# EasyEDA Pro project 15P1D_EDA.eprj

# Schematic SCH

## Sheets
1 P1: Board Name: B1; Create Date: 2024-03-08; Page Name: P1; Project Name: 15P1D_EDA; Schematic Name: SCH; Update Date: 2026-03-26; Company: EDA设计与开发; Page Size: A4; Version: V1.0
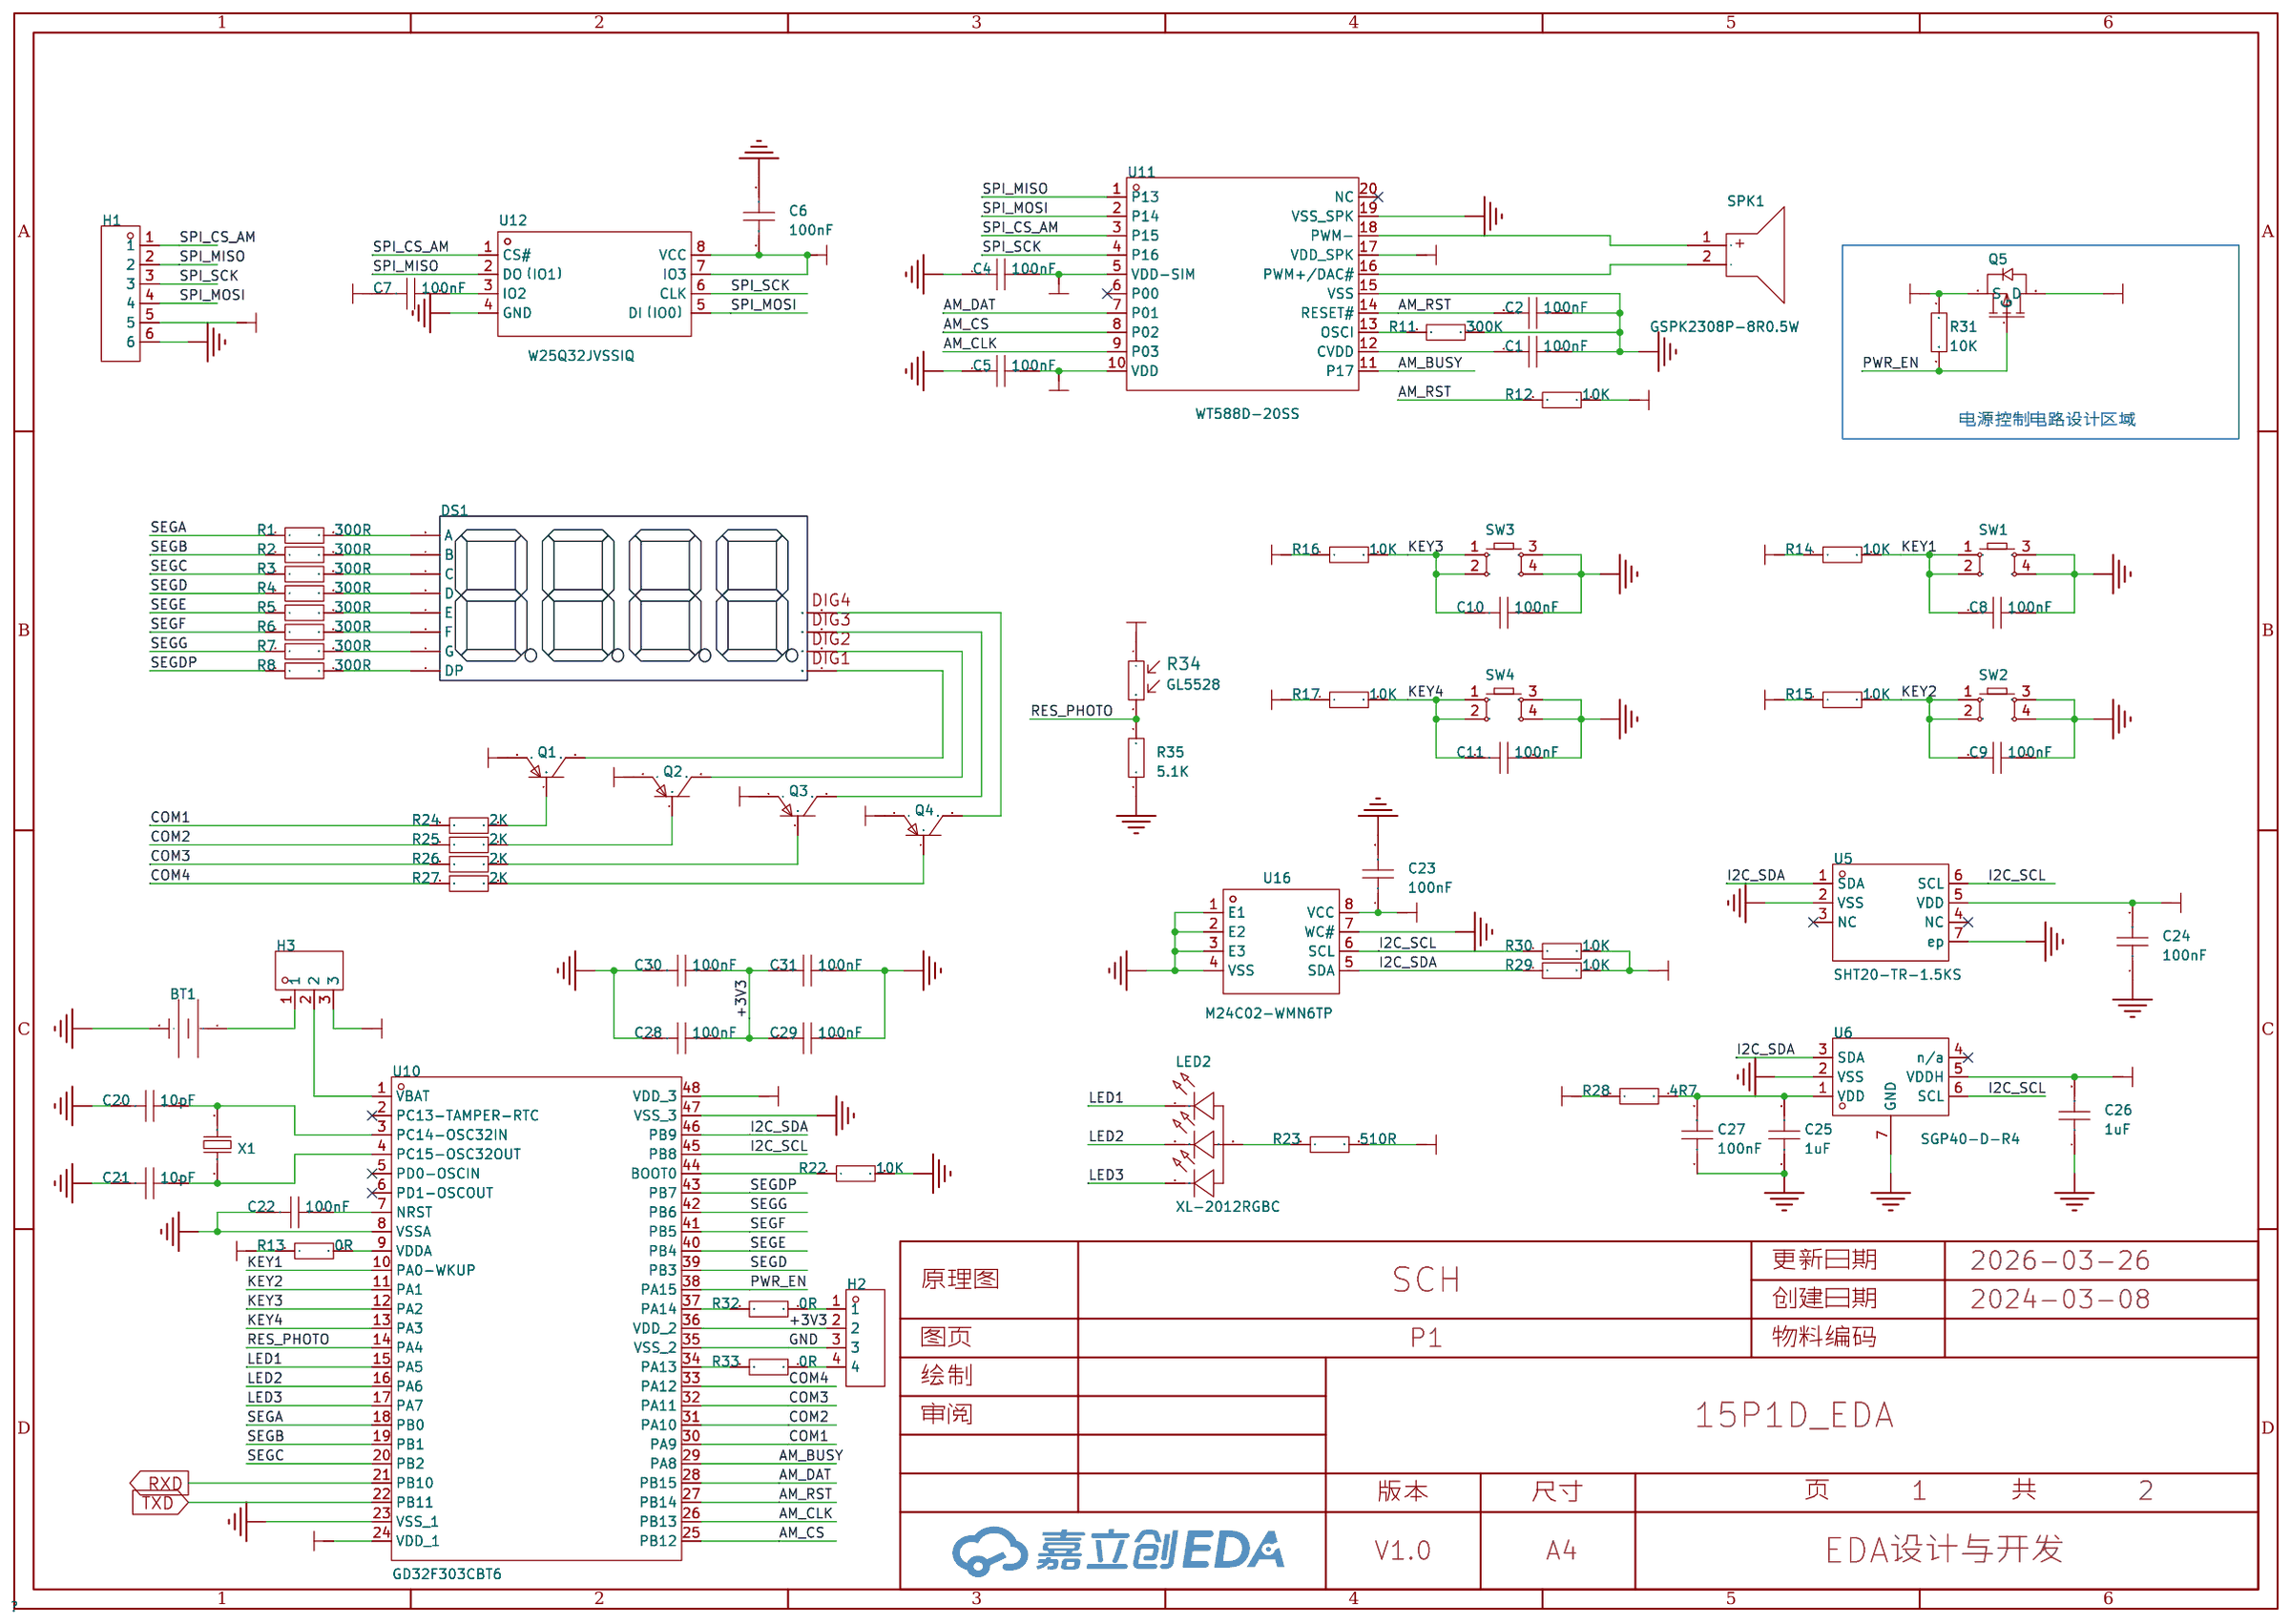
[diagram p0: P1]
2 P2: Create Date: 2024-03-12; Page Name: P2; Company: 嘉立创EDA
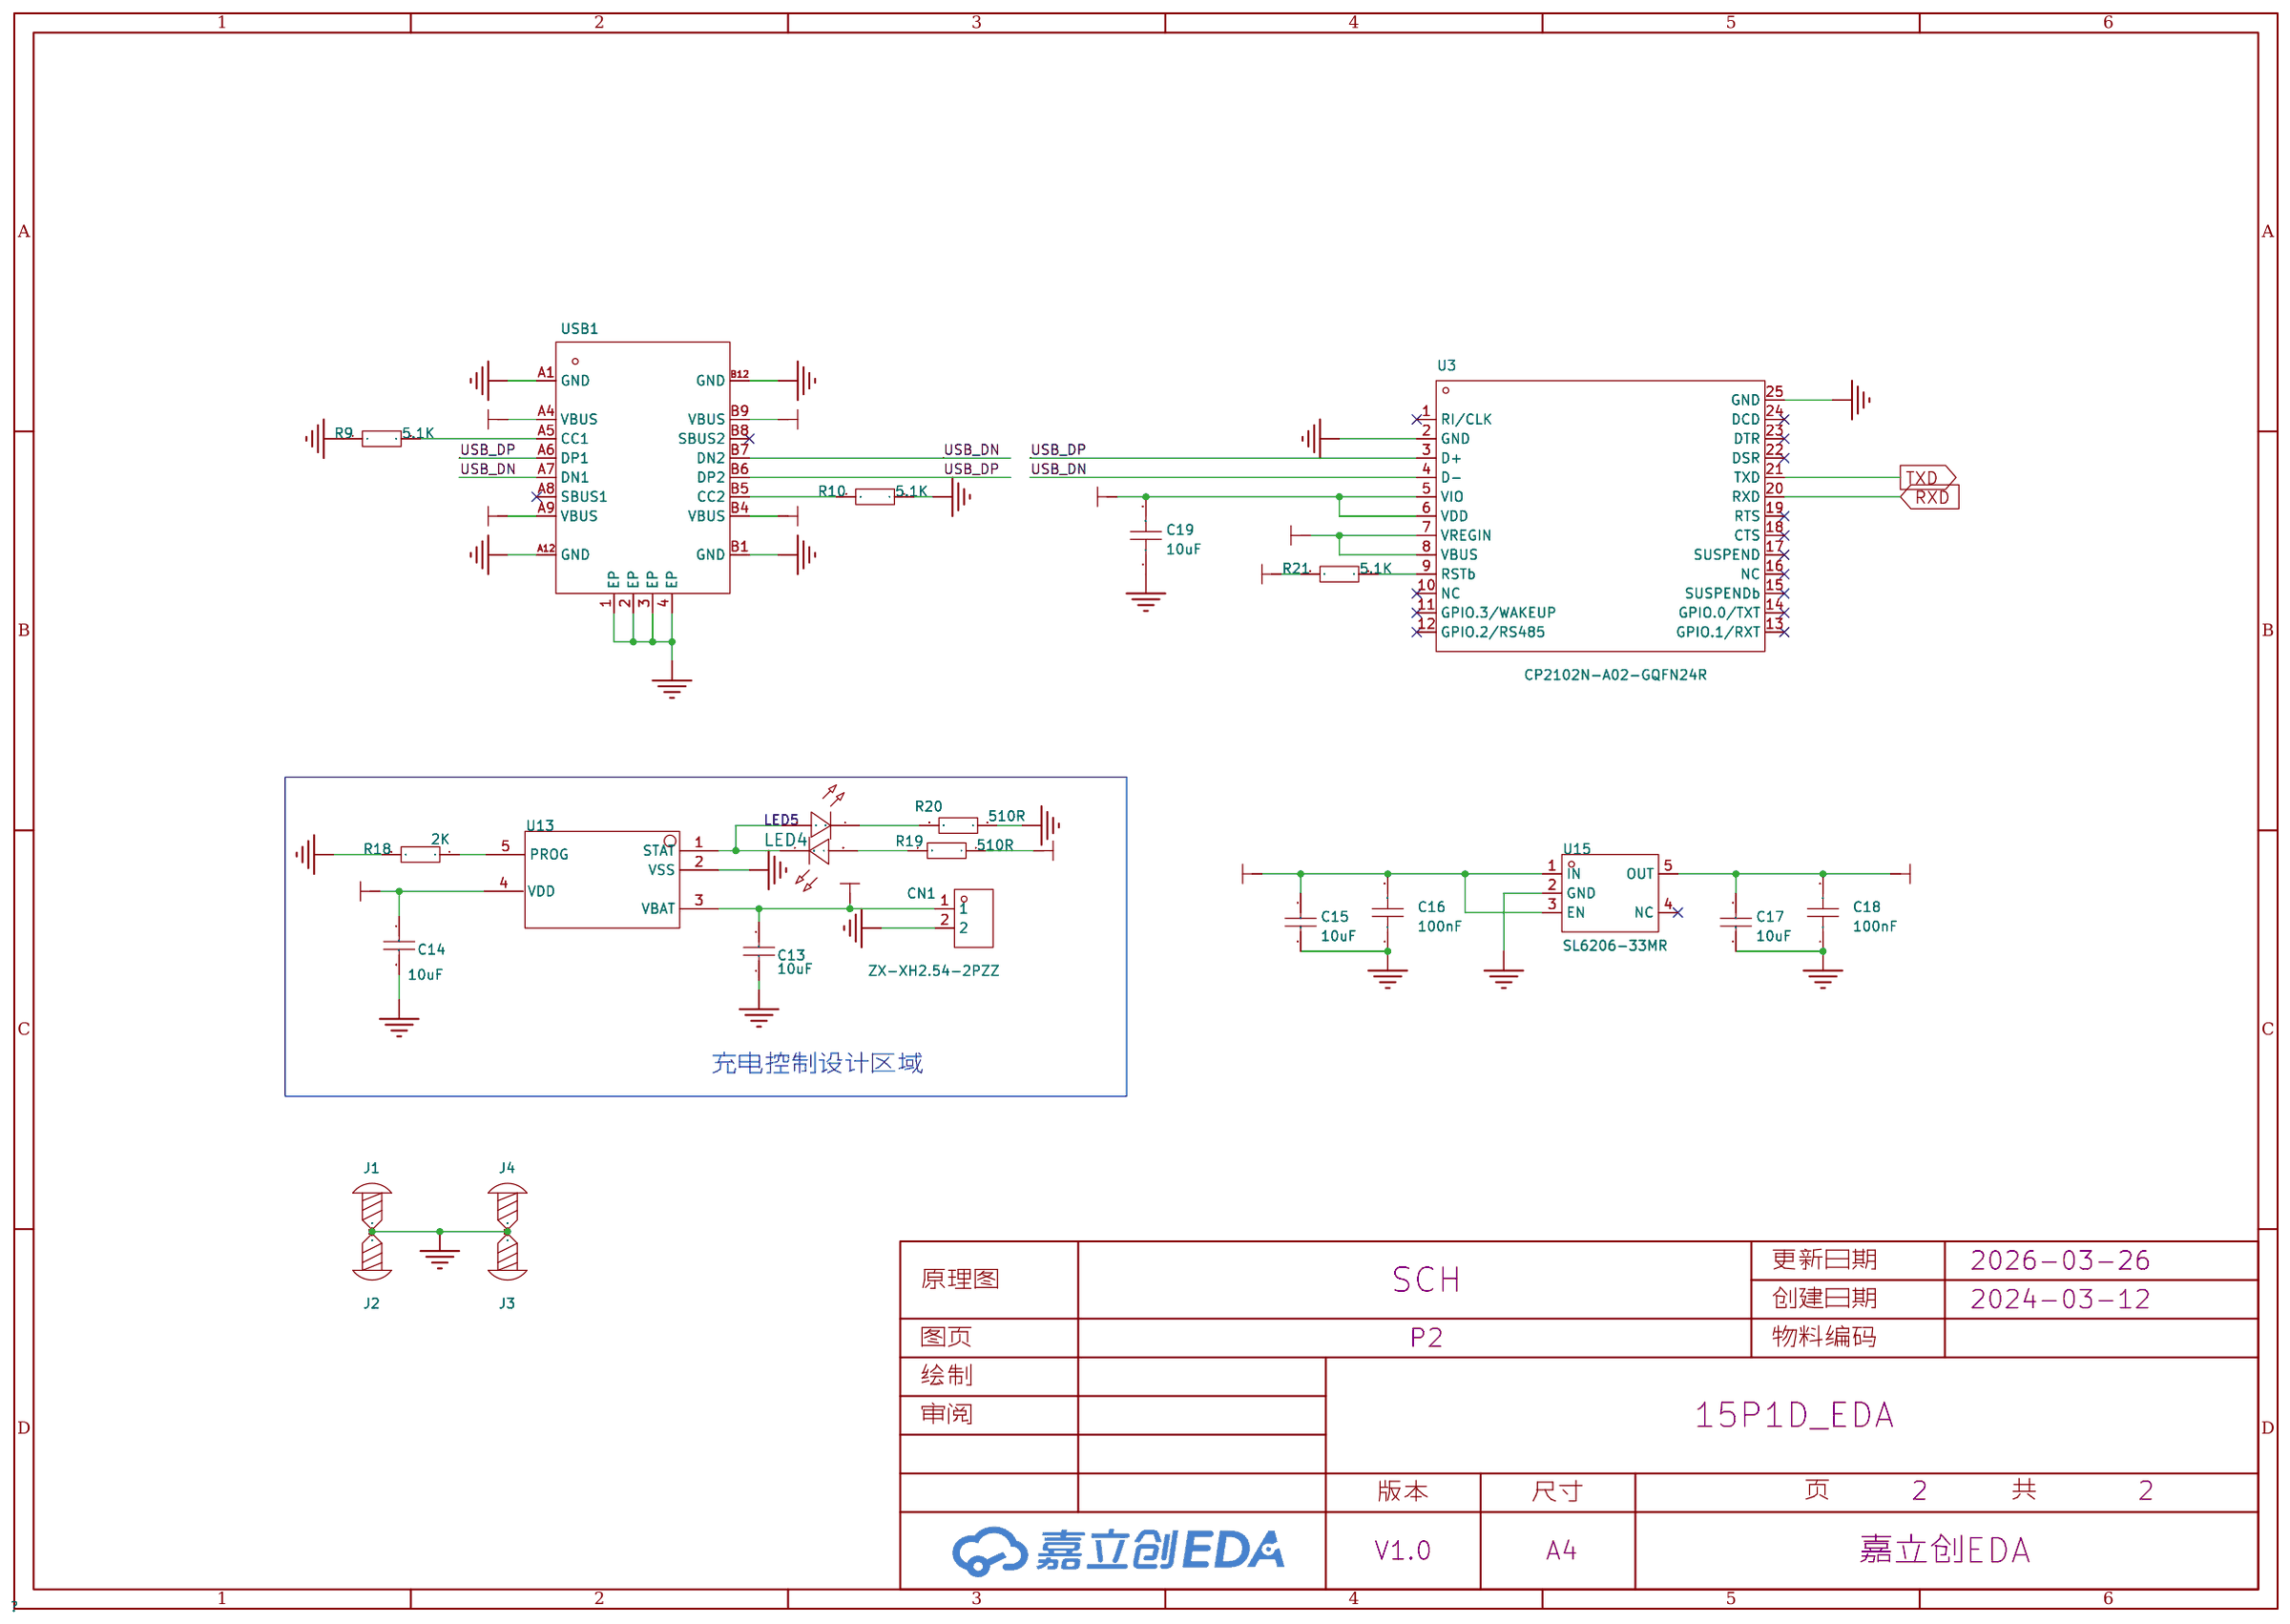
[diagram p1: P2]

## Parts
sheet P1
BT1  BS-12-B3AA003  [BAT-SMD_BS-12-B3AA011]
C1  100nF  [C0805]
C2  100nF  [C0805]
C4  100nF  [C0805]
C5  100nF  [C0805]
C6  100nF  [C0805]
C7  100nF  [C0805]
C8  100nF  [C0805]
C9  100nF  [C0805]
C10  100nF  [C0805]
C11  100nF  [C0805]
C20  10pF  [C0805]
C21  10pF  [C0805]
C22  100nF  [C0805]
C23  100nF  [C0805]
C24  100nF  [C0805]
C25  1uF  [C0805]
C26  1uF  [C0805]
C27  100nF  [C0805]
C28  100nF  [C0805]
C29  100nF  [C0805]
C30  100nF  [C0805]
C31  100nF  [C0805]
DS1  -  [LED-SEG-TH_FJ5461AH]
H1  -  [HDR-TH_6P-P2.54-V-F]
H2  -  [HDR-TH_4P-P2.54-V-F]
H3  Jumper3  [HDR-TH_3P-P2.54-V-M-A]
LED2  XL-2012RGBC  [LED-SMD_4P-L2.0-W1.3-BR]
Q1  -  [S8550P_SOT]
Q2  -  [S8550P_SOT]
Q3  -  [S8550P_SOT]
Q4  -  [S8550P_SOT]
Q5  -  [AO3401A_SOT-23-3]
R1  300R  [R0805]
R2  300R  [R0805]
R3  300R  [R0805]
R4  300R  [R0805]
R5  300R  [R0805]
R6  300R  [R0805]
R7  300R  [R0805]
R8  300R  [R0805]
R11  300K  [R0805]
R12  10K  [R0805]
R13  0R  [R0805]
R14  10K  [R0805]
R15  10K  [R0805]
R16  10K  [R0805]
R17  10K  [R0805]
R22  10K  [R0805]
R23  510R  [R0805]
R24  2K  [R0805]
R25  2K  [R0805]
R26  2K  [R0805]
R27  2K  [R0805]
R28  4R7  [R0805]
R29  10K  [R0805]
R30  10K  [R0805]
R31  10K  [R0805]
R32  0R  [R0805]
R33  0R  [R0805]
R34  GL5528  [RES-TH_L5.1-W4.3-P3.40-D0.5]
R35  5.1K  [R0805]
SPK1  GSPK2308P-8R0.5W  [SPK-TH_BD23.0-P10.00-D0.8-L-RD]
SW1  -  [Key_SMD_12x12x7.3]
SW2  -  [Key_SMD_12x12x7.3]
SW3  -  [Key_SMD_12x12x7.3]
SW4  -  [Key_SMD_12x12x7.3]
U5  SHT20-TR-1.5KS  [DFN-6_L3.0-W3.0-P0.95-TR-EP]
U6  SGP40-D-R4  [DFN-6_L2.4-W2.4-P0.80-TL-EP]
U10  GD32F303CBT6  [LQFP-48_L7.0-W7.0-P0.50-LS9.0-BL]
U11  WT588D-20SS  [SSOP-20_L7.2-W5.3-P0.65-LS7.8-BL]
U12  W25Q32JVSSIQ  [SOIC-8_L5.3-W5.3-P1.27-LS8.0-BL]
U16  M24C02-WMN6TP  [SOIC-8_L4.9-W3.9-P1.27-LS6.0-BL]
X1  32.768kHz  [FC-135R_L3.2-W1.5]
sheet P2
C13  10uF  [C1206]
C14  10uF  [C1206]
C15  10uF  [C1206]
C16  100nF  [C0805]
C17  10uF  [C1206]
C18  100nF  [C0805]
C19  10uF  [C0805]
CN1  ZX-XH2.54-2PZZ  [CONN-TH_2P-P2.50_HX25003-2A]
J1  -  [M2螺丝]
J2  -  [M2螺丝]
J3  -  [M2螺丝]
J4  -  [M2螺丝]
LED4  -  [LED_0805]
LED5  -  [LED_0805]
R9  5.1K  [R0805]
R10  5.1K  [R0805]
R18  2K  [R0805]
R19  510R  [R0805]
R20  510R  [R0805]
R21  5.1K  [R0805]
U3  CP2102N-A02-GQFN24R  [QFN-24_L4.0-W4.0-P0.50-TL-EP2.6]
U13  -  [SOP_BCON]
U15  SL6206-33MR  [SOT-23-5_L2.9-W1.6-P0.95-LS2.8-BL]
USB1  -  [USB_TYPE-C-16P]

## Library data of the parts
BT1 = BS-12-B3AA003: 连接器类型:电池底座;适用电池规格:CR1220;工作温度范围:-25℃~+85℃;; Supplier Part: C964723; Manufacturer: MYOUNG(美阳); Supplier Footprint: SMD; JLCPCB Part Class: 扩展库; Datasheet: https://atta.szlcsc.com/upload/public/pdf/source/20201218/C964723_733B638E287393F86295A2A4DAE43C75.pdf; Supplier: LCSC; Connector Type: 电池底座; Battery Type: CR1220; Operating Temperature Range: -25℃~+85℃
C1 C2 C4-C11 C16 C18-C31 = CAP_0805: Supplier Footprint: 0805
DS1 = LED_SEG_TH_0.56x4: Supplier Footprint: 插件
H1 = HDR-F_2.54_1x6P: Supplier Part: C40877; Supplier Footprint: 插件
H2 = HDR-F_2.54_1x4P: Supplier Part: C2718488; Supplier Footprint: 插件
H3 = Jumper3: Supplier Part: C2940050; Supplier Footprint: HDR-TH-3P-2.54mm; JLCPCB Part Class: 扩展库; Supplier: LCSC
LED2 = XL-2012RGBC: 发光颜色:RGB三色;功率:80mW；80mW；55mW;正向电流:25mA;主波长:619nm~624nm；463nm~466nm；524nm~527nm;二极管配置:-;透镜颜色:无色透明透镜;色温:-;发光角度:120°;载带方式:正贴;工作温度:-30℃~+85℃;; Supplier Part: C965848; Manufacturer: XINGLIGHT(成兴光); Supplier Footprint: 0805; JLCPCB Part Class: 扩展库; Datasheet: https://atta.szlcsc.com/upload/public/pdf/source/20221102/35E310354F68AE1BCFC07B93F5E395D6.pdf; Supplier: LCSC; Emitted Color: RGB三色; Power Dissipation: 80mW；80mW；55mW; Forward Current: 25mA; Dominant Wavelength: 619nm~624nm；463nm~466nm；524nm~527nm; Peak Wavelength: 624nm；528nm；469nm; Lens Color: 无色透明透镜; Viewing Angle: 120°; Mounting Sytle: 正贴; Operating Temperature: -30℃~+85℃
Q1-Q4 = S8550_SOT_PNP: Supplier Footprint: SOT-23
Q5 = AO3401A_P: Supplier Footprint: SOT-23-3L; Supplier Part: C15127
R1-R33 R35 = Res_0805: Supplier Footprint: 0805
R34 = GL5528: 暗电阻:1MΩ;亮电阻 @ 10Lux:8kΩ~20kΩ;光谱峰值(波长):540nm;; LCSC Part Name: 亮电阻:8kΩ~20kΩ 暗电阻:1MΩ; Supplier Part: C125627; Manufacturer: 森霸; Supplier Footprint: 插件,P=3mm; JLCPCB Part Class: 扩展库; Datasheet: https://atta.szlcsc.com/upload/public/pdf/source/20230427/842A99E3D53A83729D7968886D4EFCBB.pdf; Supplier: LCSC; Dark Resistance: 1MΩ; Illuminated Resistance @ 10Lux: 8kΩ~20kΩ; Applied Voltage: 150V; Spectral Peak: 540nm
SPK1 = GSPK2308P-8R0.5W: Supplier Part: C530532; Manufacturer: INGHAi(赢海); JLCPCB Part Class: 扩展库; Datasheet: https://atta.szlcsc.com/upload/public/pdf/source/20200723/C530532_3DB1F973601B36F20FBCCA52751811A3.pdf; Supplier: LCSC
SW1-SW4 = Key_SMD_12x12x7.3: Supplier Footprint: SMD
U5 = SHT20-TR-1.5KS: 接口类型:I2C;; LCSC Part Name: 1-100706-01; Supplier Part: C53865; Manufacturer: Sensirion(瑞士盛思锐); Supplier Footprint: DFN-6-EP(3x3); JLCPCB Part Class: 扩展库; Datasheet: https://atta.szlcsc.com/upload/public/pdf/source/20151012/1457707445424.pdf; Supplier: LCSC; Interface Type: I2C; Supply Voltage: 2.1V~3.6V
U6 = SGP40-D-R4: 气体类型:空气质量;精度:-;; LCSC Part Name: 3.000.384; Supplier Part: C2874215; Manufacturer: Sensirion(瑞士盛思锐); Supplier Footprint: DFN-6-EP(2.4x2.4); JLCPCB Part Class: 扩展库; Datasheet: https://atta.szlcsc.com/upload/public/pdf/source/20231011/67A6038984BE66B07B1FF2325C50691F.pdf; Supplier: LCSC; Type: 空气质量; Operating Temperature: -10℃~+50℃
U10 = GD32F303CBT6_C3013779: CPU内核:CM4;程序存储容量:128KB;RAM总容量:32KB;GPIO端口数量:37;工作电压范围:-;CPU最大主频:120MHz;程序存储器类型:FLASH;; Supplier Part: C3013779; Manufacturer: GigaDevice(兆易创新); Supplier Footprint: LQFP-48(7x7); JLCPCB Part Class: 扩展库; Datasheet: https://atta.szlcsc.com/upload/public/pdf/source/20220624/E1A57ED816B162D6D1424864911A792F.pdf; Supplier: LCSC; CPU Core: CM4; Program Storage Size: 128KB; RAM Size: 32KB; GPIO Ports Number: 37; CPU Maximum Speed: 120MHz; Program Memory Type: FLASH; ADC (Bit): 12bit; DAC (Bit): 12bit; 16Bit Timer: 7; CAN: 1; UART/USART: 3; I2C: 2; I2S: 2; SPI: 3; Peripheral/Function: 看门狗；RTC实时时钟; Watchdog: 有; Real-Time Clock: 有
U11 = WT588D-20SS: 高品质语音芯片; Supplier Part: C87498; Manufacturer: WT(唯创知音); Supplier Footprint: SSOP-20-208mil; JLCPCB Part Class: 扩展库; Datasheet: https://atta.szlcsc.com/upload/public/pdf/source/20161217/1481939141189.pdf; Supplier: LCSC
U12 = W25Q32JVSSIQ_C82344: 接口类型:SPI;存储容量:32Mbit;; Supplier Part: C82344; Manufacturer: WINBOND(华邦); Supplier Footprint: SOIC-8-208mil; JLCPCB Part Class: 扩展库; Datasheet: https://atta.szlcsc.com/upload/public/pdf/source/20160910/1473490310454.pdf; Supplier: LCSC; Interface Type: SPI; Memory Size: 32Mbit; Supply Voltage: 2.7V~3.6V; Page Programming Time (Tpp): 3ms; Operating Temperature: -40℃~+85℃
U16 = M24C02-WMN6TP: 接口类型:I2C;存储容量:2Kbit;; Supplier Part: C7562; Manufacturer: ST(意法半导体); Supplier Footprint: SOIC-8; JLCPCB Part Class: Extended Part; Datasheet: https://atta.szlcsc.com/upload/public/pdf/source/20140724/1457707167301.pdf; Supplier: LCSC; Interface Type: I2C; Memory Size: 2Kbit; Supply Voltage: 2.5V~5.5V; Operating Temperature: -40℃~+85℃
X1 = Q13FC13500004_C32346: 晶振类型:贴片晶振;频率:32.768kHz;常温频差:±20ppm;外接负载电容:12.5pF;; LCSC Part Name: 32.768kHz ±20ppm 12.5pF; Supplier Part: C32346; Manufacturer: EPSON(爱普生); Manufacturer Part: Q13FC13500004; Supplier Footprint: SMD3215-2P; JLCPCB Part Class: 基础库; Datasheet: https://atta.szlcsc.com/upload/public/pdf/source/20190108/C32346_746D6B07EAF90824457A96480007685F.pdf; Supplier: LCSC; Crystal Type: 贴片晶振; Normal temperature Frequency Tolerance: ±20ppm; External load capacitor: 12.5pF; Equivalent Series Resistance (ESR): 70kΩ; Operating Temperature: -40℃~+85℃
C13-C15 C17 = CL31A106KBHNNNE: 容值:10uF;精度:±10%;额定电压:50V;材质(温度系数):X5R;; LCSC Part Name: 10uF ±10% 50V; Supplier Part: C13585; Manufacturer: SAMSUNG(三星); Supplier Footprint: 1206; JLCPCB Part Class: 基础库; Datasheet: https://atta.szlcsc.com/upload/public/pdf/source/20160218/1457707763339.pdf; Supplier: LCSC; Tolerance: ±10%; Voltage Rated: 50V; Temperature Coefficient: X5R
CN1 = ZX-XH2.54-2PZZ: 插针结构:1x2P;间距:2.54mm;安装方式:直插;参考系列:XH;总PIN数:2P;排数:1;每排PIN数:2;行距:-;额定电流:3A;触头材质:黄铜;触头镀层:锡;工作温度范围:-25℃~+85℃;; Supplier Part: C7429632; Manufacturer: Megastar(兆星); Supplier Footprint: 插件,P=2.54mm; JLCPCB Part Class: 扩展库; Datasheet: https://atta.szlcsc.com/upload/public/pdf/source/20230619/19BA6947230AA44A04D3EDD65E618FD0.pdf; Supplier: LCSC; Pins Structure: 1x2P; Pitch: 2.54mm; Mounting Style: 直插; Reference Series: XH; Number of Pins: 2P; Number of Rows: 1; Number of PINs Per Row: 2; Current Rating (Max): 3A; Contact Material: 黄铜; Contact Plating: 锡; Operating Temperature Range: -25℃~+85℃
J1-J4 = M2螺丝: Supplier Footprint: 插件
LED4 = LED_0805-R: Supplier Footprint: 0805
LED5 = LED_0805-G: Supplier Footprint: 0805
U3 = CP2102N-A02-GQFN24R: 应用功能:USB转UART;接口协议:UART;; Supplier Part: C969151; Manufacturer: SKYWORKS/SILICON LABS(芯科); Supplier Footprint: QFN-24-EP(4x4); JLCPCB Part Class: 扩展库; Datasheet: https://atta.szlcsc.com/upload/public/pdf/source/20201204/C964632_F2B790CC23A72455AEF523510305B30A.pdf; Supplier: LCSC; Applications Function: USB转UART; Protocol: UART; Supply Voltage: 3V~3.6V; Operating Temperature: -40℃~+85℃@(Ta)
U13 = BCON
U15 = SL6206-33MR: 输出类型:-;; Supplier Part: C707122; Manufacturer: Slkor(萨科微); Supplier Footprint: SOT-23-5; JLCPCB Part Class: 扩展库; Datasheet: https://atta.szlcsc.com/upload/public/pdf/source/20200721/C707121_33633D17E61D5DC97F22208BE63A0FB1.pdf; Supplier: LCSC
USB1 = USB_TYPE-C-16P: Supplier Footprint: SMD

## Nets
+3V3: C4.2 C5.2 C6.2 C7.1 C17.2 C18.2 C19.2 C23.1 C28.1 C29.2 C30.1 C31.2 H1.5 H2.2 H3.3 Q1.2(E) Q2.2(E) Q3.2(E) Q4.2(E) Q5.2(S) R12.2 R13.1 R14.1 R15.1 R16.1 R17.1 R21.2 R23.2 R29.2 R30.2 R31.1 R34.1 U3.5(VIO) U3.6(VDD) U10.24(VDD_1) U10.36(VDD_2) U10.48(VDD_3) U11.5(VDD-SIM) U11.10(VDD) U11.17(VDD_SPK) U12.7(IO3) U12.8(VCC) U15.5(OUT) U16.8(VCC)
GND: BT1.2(-) C1.2 C2.2 C4.1 C5.1 C6.1 C8.2 C9.2 C10.2 C11.2 C13.2 C14.2 C15.1 C16.1 C17.1 C18.1 C19.1 C20.1 C21.1 C22.1 C23.2 C24.1 C25.1 C26.1 C27.1 C28.2 C29.1 C30.2 C31.1 CN1.2 H1.6 H2.3 J1.1 J2.1 J3.1 J4.1 R9.1 R10.1 R11.2 R18.2 R20.1 R22.2 R35.2 SW1.3 SW1.4 SW2.3 SW2.4 SW3.3 SW3.4 SW4.3 SW4.4 U3.2(GND) U3.25(GND) U5.2(VSS) U5.7(ep) U6.2(VSS) U6.7(GND) U10.8(VSSA) U10.23(VSS_1) U10.35(VSS_2) U10.47(VSS_3) U11.15(VSS) U11.19(VSS_SPK) U12.4(GND) U13.2(VSS) U15.2(GND) U16.1(E1) U16.2(E2) U16.3(E3) U16.4(VSS) U16.7(WC#) USB1.1(EP) USB1.2(EP) USB1.3(EP) USB1.4(EP) USB1.A1(GND) USB1.A12(GND) USB1.B1(GND) USB1.B12(GND)
VBAT: C13.1 C15.2 C16.2 CN1.1 U13.3(VBAT) U15.1(IN) U15.3(EN)
VBUS: C14.1 R19.1 U3.7(VREGIN) U3.8(VBUS) U13.4(VDD) USB1.A4(VBUS) USB1.A9(VBUS) USB1.B4(VBUS) USB1.B9(VBUS)
+VS: C24.2 C26.2 Q5.3(D) R28.1 U5.5(VDD) U6.5(VDDH)
AM_BUSY: U10.29(PA8) U11.11(P17)
AM_CLK: U10.26(PB13) U11.9(P03)
AM_CS: U10.25(PB12) U11.8(P02)
AM_DAT: U10.28(PB15) U11.7(P01)
AM_RST: C2.1 R12.1 U10.27(PB14) U11.14(RESET#)
COM1: R24.1 U10.30(PA9)
COM2: R25.1 U10.31(PA10)
COM3: R26.1 U10.32(PA11)
COM4: R27.1 U10.33(PA12)
I2C_SCL: R30.1 U5.6(SCL) U6.6(SCL) U10.45(PB8) U16.6(SCL)
I2C_SDA: R29.1 U5.1(SDA) U6.3(SDA) U10.46(PB9) U16.5(SDA)
KEY1: C8.1 R14.2 SW1.1 SW1.2 U10.10(PA0-WKUP)
KEY2: C9.1 R15.2 SW2.1 SW2.2 U10.11(PA1)
KEY3: C10.1 R16.2 SW3.1 SW3.2 U10.12(PA2)
KEY4: C11.1 R17.2 SW4.1 SW4.2 U10.13(PA3)
LED1: LED2.1 U10.15(PA5)
LED2: LED2.2 U10.16(PA6)
LED3: LED2.4 U10.17(PA7)
PWR_EN: Q5.1(G) R31.2 U10.38(PA15)
RES_PHOTO: R34.2 R35.1 U10.14(PA4)
RXD: U3.20(RXD) U10.21(PB10)
SEGA: R1.1 U10.18(PB0)
SEGB: R2.1 U10.19(PB1)
SEGC: R3.1 U10.20(PB2)
SEGD: R4.1 U10.39(PB3)
SEGDP: R8.1 U10.43(PB7)
SEGE: R5.1 U10.40(PB4)
SEGF: R6.1 U10.41(PB5)
SEGG: R7.1 U10.42(PB6)
SPI_CS_AM: H1.1 U11.3(P15) U12.1(CS#)
SPI_MISO: H1.2 U11.1(P13) U12.2(DO（IO1）)
SPI_MOSI: H1.4 U11.2(P14) U12.5(DI（IO0）)
SPI_SCK: H1.3 U11.4(P16) U12.6(CLK)
TXD: U3.21(TXD) U10.22(PB11)
USB_DN: U3.4(D-) USB1.A7(DN1) USB1.B7(DN2)
USB_DP: U3.3(D+) USB1.A6(DP1) USB1.B6(DP2)
$1N1449: DS1.8(DIG3) Q3.3(C)
$1N1467: DS1.1(E) R5.2
$1N1471: DS1.2(D) R4.2
$1N1475: DS1.3(DP) R8.2
$1N1479: DS1.4(C) R3.2
$1N1483: DS1.5(G) R7.2
$1N1487: DS1.11(A) R1.2
$1N1491: DS1.7(B) R2.2
$1N1495: DS1.10(F) R6.2
$1N6161: C1.1 U11.12(CVDD)
$1N6192: R11.1 U11.13(OSCI)
$1N6375: SPK1.1(+) U11.18(PWM-)
$1N6384: SPK1.2(-) U11.16(PWM+/DAC#)
$1N6917: C7.2 U12.3(IO2)
$1N7212: R13.2 U10.9(VDDA)
$1N7925: C20.2 U10.3(PC14-OSC32IN) X1.1
$1N7930: C21.2 U10.4(PC15-OSC32OUT) X1.2
$1N8028: R22.1 U10.44(BOOT0)
$1N8104: LED2.3 R23.1
$1N8256: DS1.12(DIG1) Q1.3(C)
$1N8335: DS1.9(DIG2) Q2.3(C)
$1N8343: DS1.6(DIG4) Q4.3(C)
$1N8477: Q1.1(B) R24.2
$1N8481: Q2.1(B) R25.2
$1N8485: Q3.1(B) R26.2
$1N8489: Q4.1(B) R27.2
$1N8598: C22.2 U10.7(NRST)
$1N9384: C25.2 C27.2 R28.2 U6.1(VDD)
$1N9794: R32.1 U10.37(PA14)
$1N9795: H2.1 R32.2
$1N9824: R33.1 U10.34(PA13)
$1N9825: H2.4 R33.2
$1N10132: BT1.1(+) H3.1
$1N10135: H3.2 U10.1(VBAT)
$2N394: R9.2 USB1.A5(CC1)
$2N397: R10.2 USB1.B5(CC2)
$2N1836: R21.1 U3.9(RSTb)
$2N6448: R18.1 U13.5(PROG)
$2N6491: LED5.1(C) R20.2
$2N6496: LED4.2(A) R19.2
$2N6506: LED4.1(C) LED5.2(A) U13.1(STAT)

Not connected (* = marked no-connect by the designer): U3 1(RI/CLK)* 10(NC)* 11(GPIO.3/WAKEUP)* 12(GPIO.2/RS485)* 13(GPIO.1/RXT)* 14(GPIO.0/TXT)* 15(SUSPENDb)* 16(NC)* 17(SUSPEND)* 18(CTS)* 19(RTS)* 22(DSR)* 23(DTR)* 24(DCD)*; U5 3(NC)* 4(NC)*; U6 4(n/a)*; U10 2(PC13-TAMPER-RTC)* 5(PD0-OSCIN)* 6(PD1-OSCOUT)*; U11 6(P00)* 20(NC)*; U15 4(NC)*; USB1 A8(SBUS1)* B8(SBUS2)*

## Notes on the sheets
sheet 1
- 电源控制电路设计区域
sheet 2
- 充电控制设计区域

# Board PCB
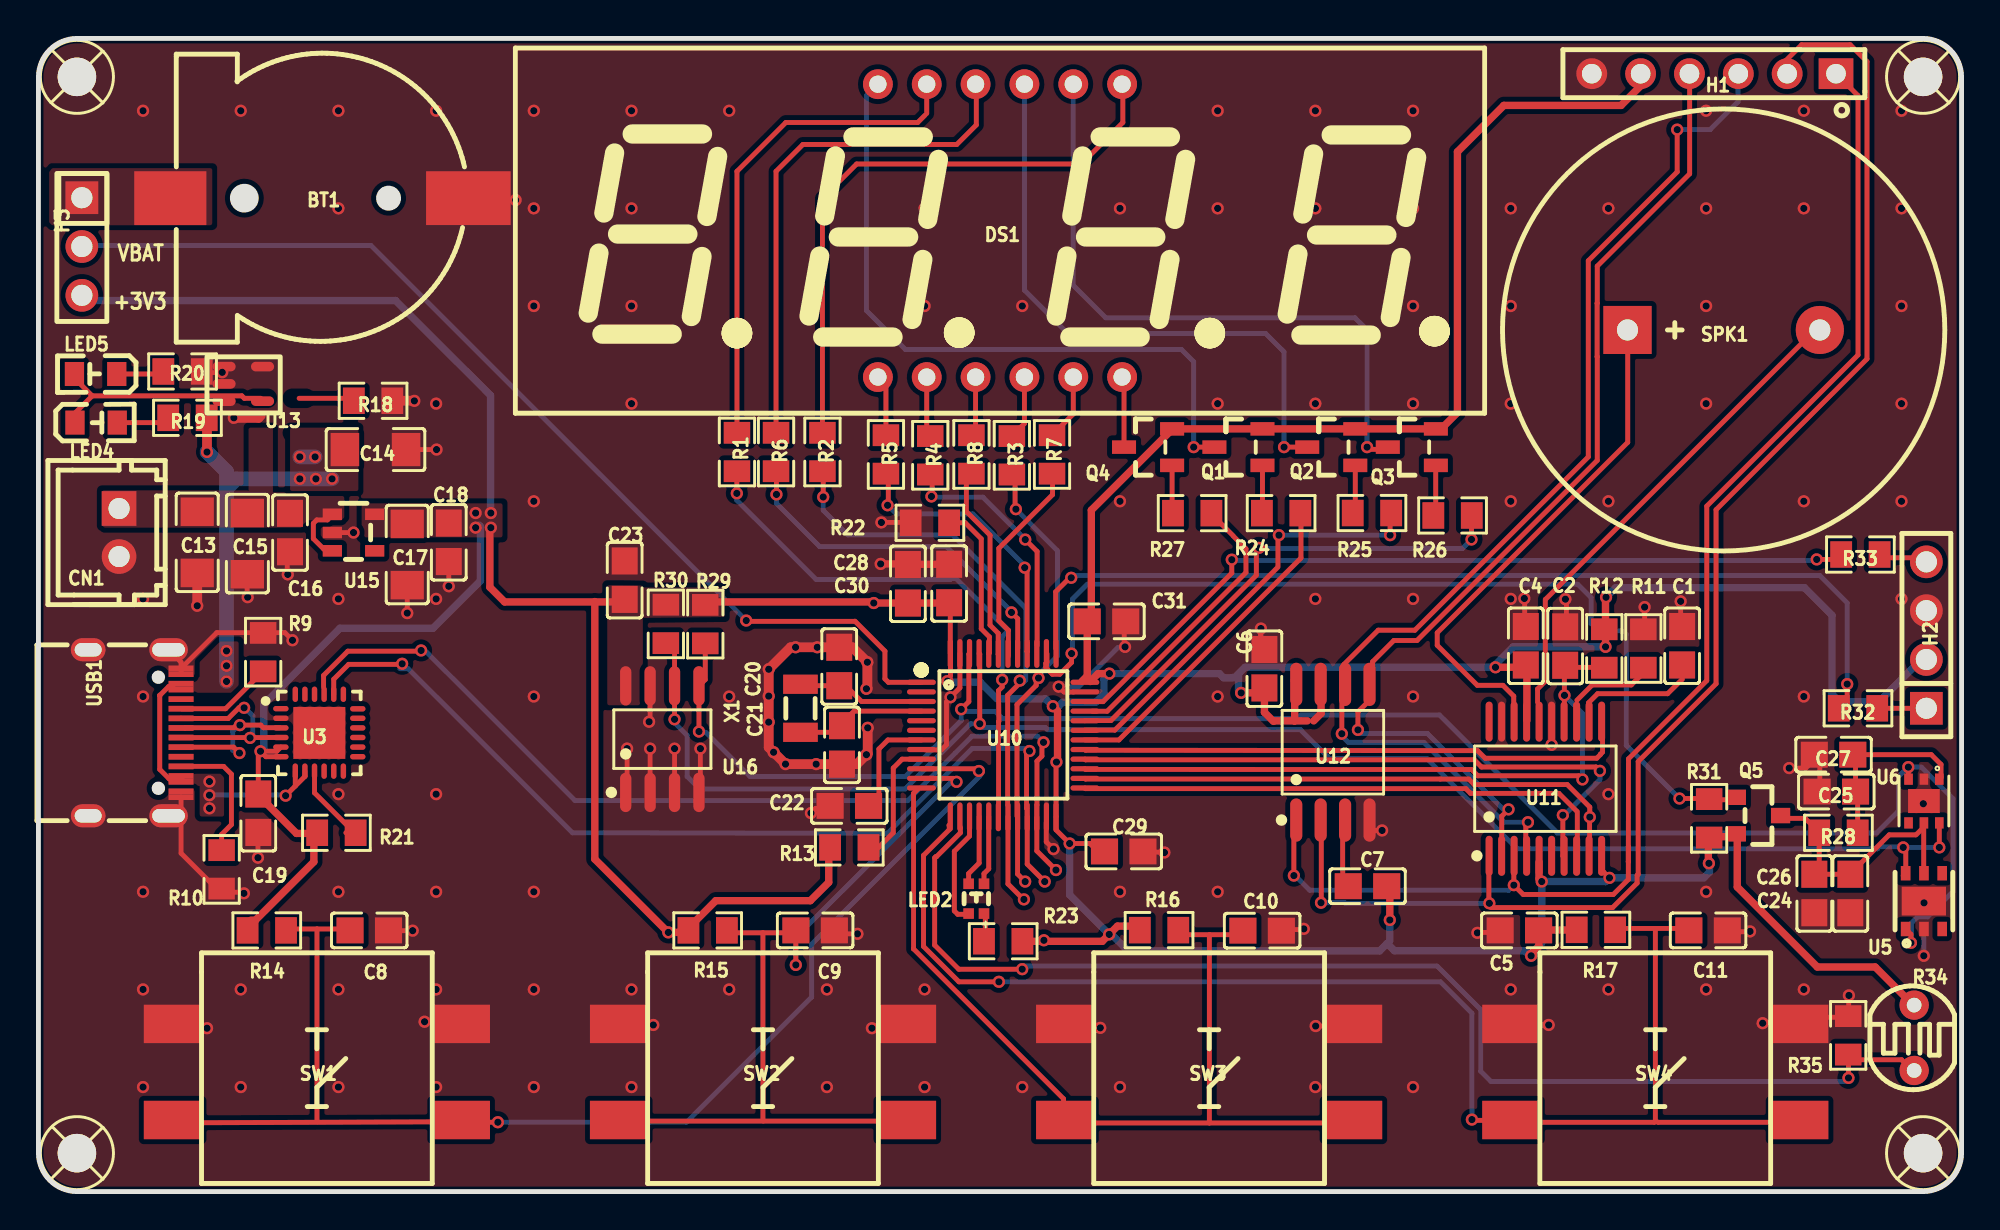
[diagram p2: board, top side]
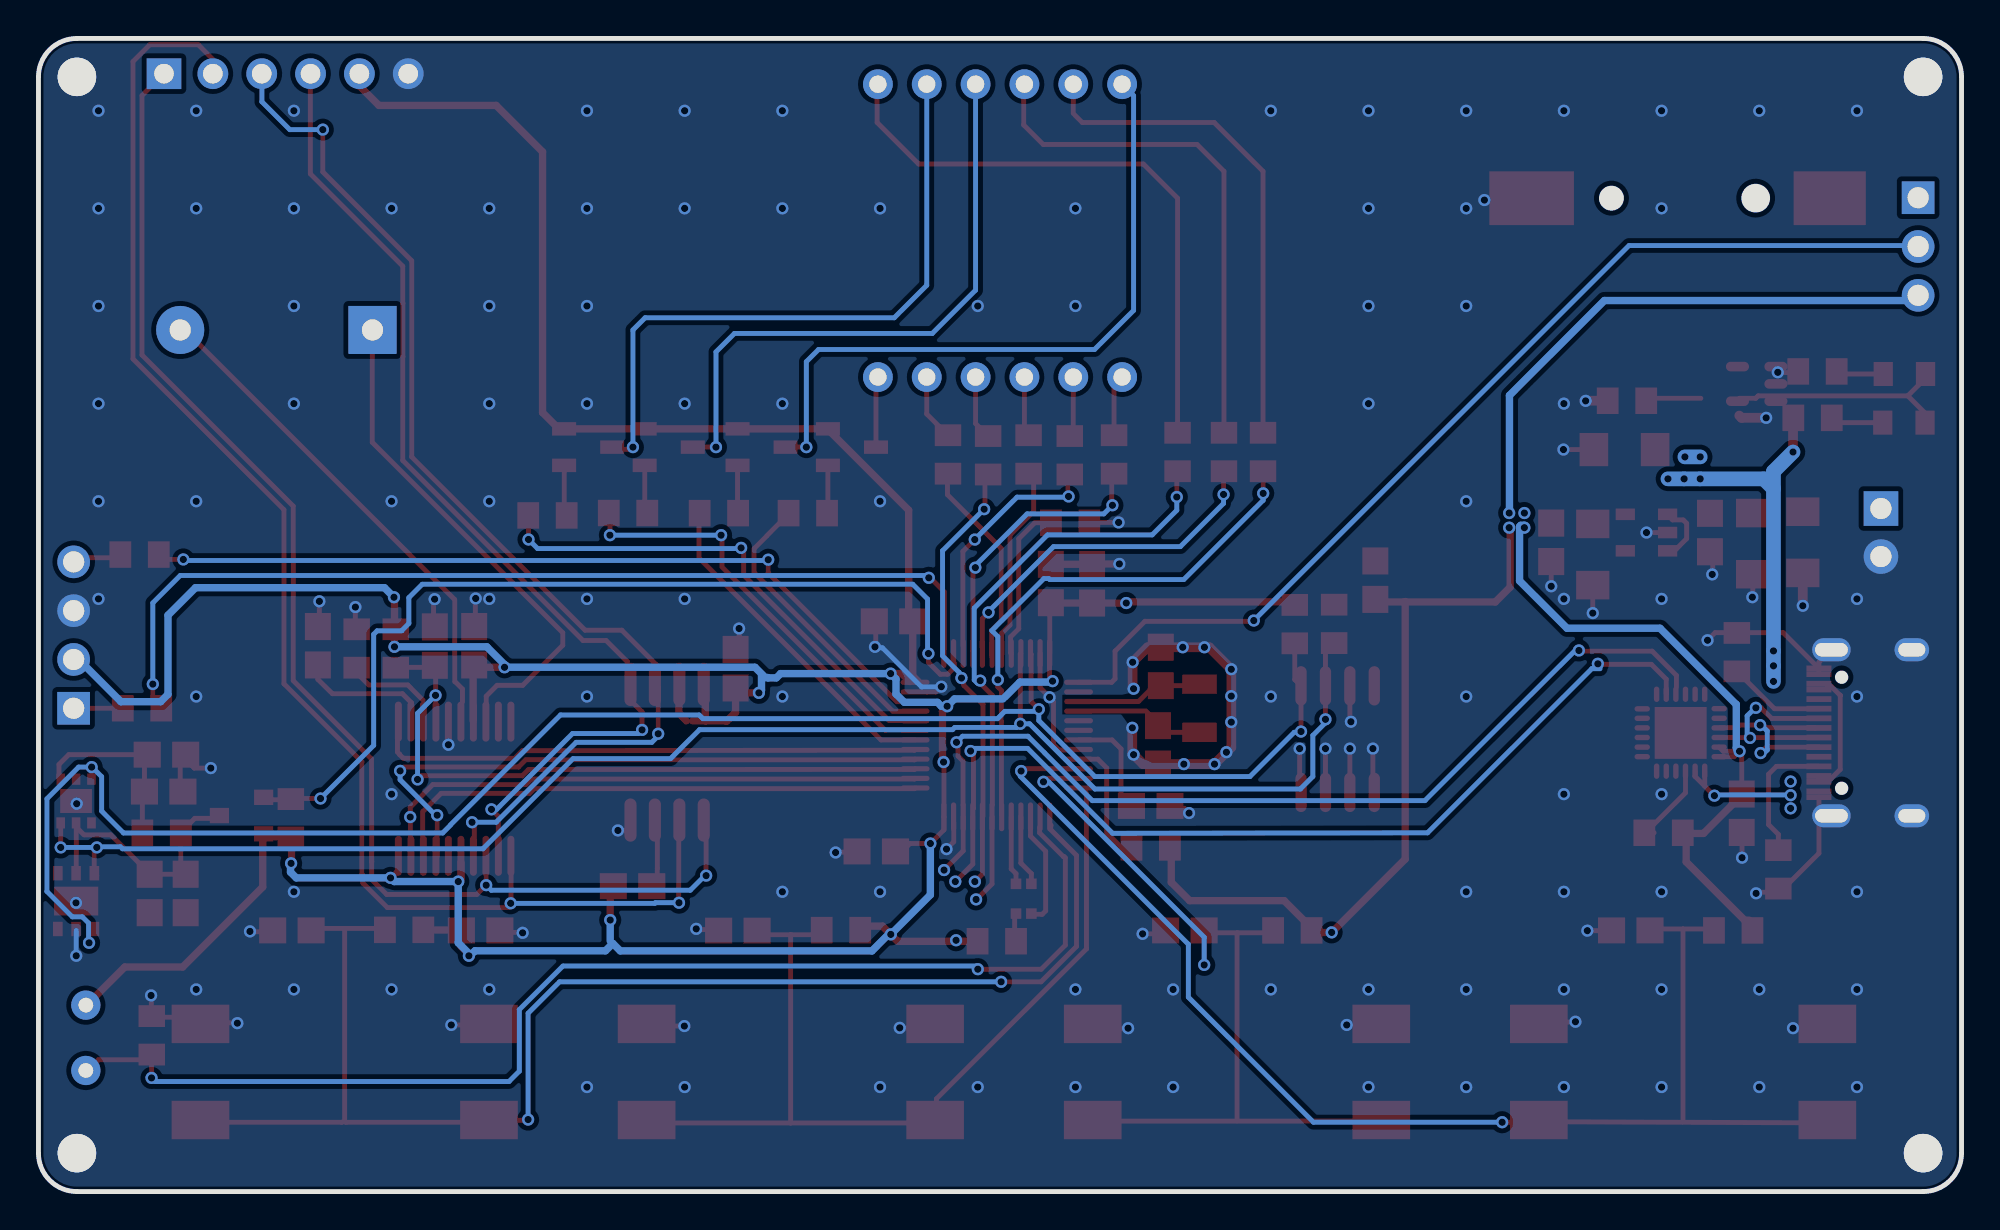
[diagram p3: board, bottom side, seen from below]

Outline 100 x 60 mm; copper layers: Top Layer, Bottom Layer. Coordinates in mm from the lower left corner of the outline.
Outline path: 0,58 0,2 arc(0.59,0.59) 2,0 98,0 arc(99.41,0.59) 100,2 100,58 arc(99.41,59.41) 98,60 2,60 arc(0.59,59.41) 0,58
Stack: Top Layer 0.035mm / Dielectric1 1.51mm FR4 er 4.5 / Bottom Layer 0.035mm

## Design rules (mm)
template: 自定义配置
spacing copperThickness1oz (default): track to track 0.203, other pairs 0.178 to 0.203
spacing copperThickness2oz: track to track 0.203, other pairs 0.152 to 0.3
track width copperThickness1oz (default): min 0.254, default 0.254, max 2.54
track width copperThickness2oz: min 0.203, default 0.254, max 2.54
track width pwr: min 0.254, default 0.381, max 2.54
differential pair differentialPair (default): width min 0.127, default 0.254, max 2.54; gap min 0.152, default 0.152
via viaSize (default): diameter min 0.635, default 0.635, max 0.635; hole min 0.381, default 0.381, max 0.381
net +3V3 uses pwr

## Placement (name value [footprint] x y rotation side)
BT1  BS-12-B3AA003  [BAT-SMD_BS-12-B3AA011]  14.61 51.69 180 top
C1  100nF  [C0805]  85.47 28.4 90 top
C2  100nF  [C0805]  79.39 28.38 90 top
C4  100nF  [C0805]  77.34 28.4 270 top
C5  100nF  [C0805]  77.01 13.59 0 top
C6  100nF  [C0805]  63.75 27.21 270 top
C7  100nF  [C0805]  69.11 15.89 180 top
C8  100nF  [C0805]  17.2 13.59 0 top
C9  100nF  [C0805]  40.39 13.59 0 top
C10  100nF  [C0805]  63.63 13.58 0 top
C11  100nF  [C0805]  86.82 13.59 0 top
C13  10uF  [C1206]  8.25 33.78 270 top
C14  10uF  [C1206]  17.53 38.61 0 top
C15  10uF  [C1206]  10.86 33.71 90 top
C16  100nF  [C0805]  13.08 34.29 90 top
C17  10uF  [C1206]  19.18 33.15 90 top
C18  100nF  [C0805]  21.34 33.78 90 top
C19  10uF  [C0805]  11.43 19.69 90 top
C20  10pF  [C0805]  41.64 27.32 270 top
C21  10pF  [C0805]  41.78 23.24 90 top
C22  100nF  [C0805]  42.16 20.07 0 top
C23  100nF  [C0805]  30.48 31.81 90 top
C24  100nF  [C0805]  94.22 15.51 90 top
C25  1uF  [C0805]  93.49 20.81 0 top
C26  1uF  [C0805]  92.34 15.51 90 top
C27  100nF  [C0805]  93.34 22.73 0 top
C28  100nF  [C0805]  45.21 31.62 90 top
C29  100nF  [C0805]  56.43 17.7 180 top
C30  100nF  [C0805]  47.35 31.64 90 top
C31  100nF  [C0805]  55.54 29.67 180 top
CN1  ZX-XH2.54-2PZZ  [CONN-TH_2P-P2.50_HX25003-2A]  4.19 34.29 270 top
DS1  -  [LED-SEG-TH_FJ5461AH]  50 50 0 top
H1  -  [HDR-TH_6P-P2.54-V-F]  87.12 58.17 180 top
H2  -  [HDR-TH_4P-P2.54-V-F]  98.17 28.96 90 top
H3  Jumper3  [HDR-TH_3P-P2.54-V-M-A]  2.26 49.17 270 top
J1  -  [M2螺丝]  2 2 0 top
J2  -  [M2螺丝]  98 2 0 top
J3  -  [M2螺丝]  98 58 0 top
J4  -  [M2螺丝]  2 58 0 top
LED2  XL-2012RGBC  [LED-SMD_4P-L2.0-W1.3-BR]  48.77 15.24 270 top
LED4  -  [LED_0805]  3.05 40 0 top
LED5  -  [LED_0805]  2.92 42.55 180 top
Q1  -  [S8550P_SOT]  62.36 38.73 0 top
Q2  -  [S8550P_SOT]  67.18 38.73 0 top
Q3  -  [S8550P_SOT]  71.37 38.73 0 top
Q4  -  [S8550P_SOT]  57.66 38.73 0 top
Q5  -  [AO3401A_SOT-23-3]  89.44 19.56 180 top
R1  300R  [R0805]  36.32 38.48 90 top
R2  300R  [R0805]  40.77 38.48 90 top
R3  300R  [R0805]  50.62 38.31 90 top
R4  300R  [R0805]  46.37 38.31 90 top
R5  300R  [R0805]  44.07 38.35 90 top
R6  300R  [R0805]  38.35 38.48 90 top
R7  300R  [R0805]  52.71 38.35 90 top
R8  300R  [R0805]  48.51 38.35 90 top
R9  5.1K  [R0805]  11.68 28.07 270 top
R10  5.1K  [R0805]  9.53 16.76 90 top
R11  300K  [R0805]  83.45 28.26 90 top
R12  10K  [R0805]  81.42 28.26 90 top
R13  0R  [R0805]  42.16 17.91 0 top
R14  10K  [R0805]  11.87 13.59 0 top
R15  10K  [R0805]  34.8 13.59 0 top
R16  10K  [R0805]  58.27 13.6 0 top
R17  10K  [R0805]  80.99 13.62 0 top
R18  2K  [R0805]  17.4 41.15 0 top
R19  510R  [R0805]  7.75 40.26 180 top
R20  510R  [R0805]  7.49 42.67 180 top
R21  5.1K  [R0805]  15.49 18.67 180 top
R22  10K  [R0805]  46.35 34.8 180 top
R23  510R  [R0805]  50.17 13.02 0 top
R24  2K  [R0805]  64.62 35.3 180 top
R25  2K  [R0805]  69.34 35.31 180 top
R26  2K  [R0805]  73.53 35.18 180 top
R27  2K  [R0805]  59.99 35.3 180 top
R28  4R7  [R0805]  93.6 18.67 0 top
R29  10K  [R0805]  34.67 29.53 90 top
R30  10K  [R0805]  32.62 29.54 90 top
R31  10K  [R0805]  86.88 19.42 90 top
R32  0R  [R0805]  94.62 25.15 0 top
R33  0R  [R0805]  94.74 33.15 0 top
R34  GL5528  [RES-TH_L5.1-W4.3-P3.40-D0.5]  97.54 8 0 top
R35  5.1K  [R0805]  94.11 8.13 90 top
SPK1  GSPK2308P-8R0.5W  [SPK-TH_BD23.0-P10.00-D0.8-L-RD]  87.63 44.83 0 top
SW1  -  [Key_SMD_12x12x7.3]  14.48 6.22 0 top
SW2  -  [Key_SMD_12x12x7.3]  37.68 6.22 0 top
SW3  -  [Key_SMD_12x12x7.3]  60.88 6.22 0 top
SW4  -  [Key_SMD_12x12x7.3]  84.07 6.22 0 top
U3  CP2102N-A02-GQFN24R  [QFN-24_L4.0-W4.0-P0.50-TL-EP2.6]  14.61 23.88 0 top
U5  SHT20-TR-1.5KS  [DFN-6_L3.0-W3.0-P0.95-TR-EP]  98.04 15.11 180 top
U6  SGP40-D-R4  [DFN-6_L2.4-W2.4-P0.80-TL-EP]  98.04 20.32 270 top
U10  GD32F303CBT6  [LQFP-48_L7.0-W7.0-P0.50-LS9.0-BL]  50.16 23.75 270 top
U11  WT588D-20SS  [SSOP-20_L7.2-W5.3-P0.65-LS7.8-BL]  78.36 20.96 0 top
U12  W25Q32JVSSIQ  [SOIC-8_L5.3-W5.3-P1.27-LS8.0-BL]  67.31 22.86 0 top
U13  -  [SOP_BCON]  11.56 41.28 0 top
U15  SL6206-33MR  [SOT-23-5_L2.9-W1.6-P0.95-LS2.8-BL]  16.38 34.29 270 top
U16  M24C02-WMN6TP  [SOIC-8_L4.9-W3.9-P1.27-LS6.0-BL]  32.44 23.54 0 top
USB1  -  [USB_TYPE-C-16P]  5 24 270 top
X1  32.768kHz  [FC-135R_L3.2-W1.5]  39.62 25.15 270 top

## Footprints (pads in the part's own frame, mm; a bottom-side part is the same pattern mirrored in y, then rotated)
AO3401A_SOT-23-3
  rect 1x0.8 smd: 1(1.15,-0.95) 2(1.15,0.95) 3(-1.15,0)
BAT-SMD_BS-12-B3AA011
  rect 3.75x2.8 smd: 1(7.75,0)
  rect 4.4x2.8 smd: 2(-7.75,0)
C0805
  rect 1.41x1.35 smd: 1(-1,0) 2(1,0)
C1206
  rect 1.485x1.728 smd: 1(-1.593,0) 2(1.593,0)
CONN-TH_2P-P2.50_HX25003-2A
  rect 1.8x1.8 hole 1.1: 1(-1.25,0)
  round 1.8 hole 1.1: 2(1.25,0)
DFN-6_L2.4-W2.4-P0.80-TL-EP
  rect 0.585x0.448 smd: 1(-1.137,0.8) 2(-1.137,0) 3(-1.137,-0.8) 4(1.137,-0.8) 5(1.137,0) 6(1.137,0.8)
  rect 1.25x1.65 smd: 7(0,0)
DFN-6_L3.0-W3.0-P0.95-TR-EP
  rect 0.5x0.75 smd: 1(0.95,1.452) 2(0,1.451) 3(-0.95,1.45) 4(-0.95,-1.452) 5(0,-1.452) 6(0.95,-1.451)
  rect 2.3x1.5 smd: 7(0.004,-0.001)
FC-135R_L3.2-W1.5
  rect 1x1.8 smd: 1(-1.25,0) 2(1.25,0)
HDR-TH_3P-P2.54-V-M-A
  rect 1.7x1.7 hole 1.1: 1(-2.54,0)
  round 1.7 hole 1.1: 2(0,0) 3(2.54,0)
HDR-TH_4P-P2.54-V-F
  rect 1.7x1.7 hole 1.1: 1(-3.81,0)
  round 1.7 hole 1.1: 2(-1.27,0) 3(1.27,0) 4(3.81,0)
HDR-TH_6P-P2.54-V-F
  rect 1.8x1.6 hole 1.02: 1(-6.35,0)
  round 1.6 hole 1.02: 2(-3.81,0) 3(-1.27,0) 4(1.27,0) 5(3.81,0) 6(6.35,0)
Key_SMD_12x12x7.3
  rect 2.999x1.999 smd: 1(-7.5,-2.499) 2(7.5,-2.499) 3(7.5,2.499) 4(-7.5,2.499)
LED-SEG-TH_FJ5461AH
  round 1.55 hole 0.9: 1(-6.35,-7.62) 2(-3.81,-7.62) 3(-1.27,-7.62) 4(1.27,-7.62) 5(3.81,-7.62) 6(6.35,-7.62) 7(6.35,7.62) 8(3.81,7.62) 9(1.27,7.62) 10(-1.27,7.62) 11(-3.81,7.62) 12(-6.35,7.62)
LED-SMD_4P-L2.0-W1.3-BR
  rect 0.55x0.55 smd: 1(0.775,-0.4) 2(-0.775,-0.4) 3(0.775,0.4) 4(-0.775,0.4)
LED_0805
  rect 1x1.25 smd: 1(-1.15,0.005) 2(1.05,0.005)
LQFP-48_L7.0-W7.0-P0.50-LS9.0-BL
  oval 0.27x1.5 smd: 1(-2.75,-4.25) 2(-2.25,-4.25) 3(-1.75,-4.25) 4(-1.25,-4.25) 5(-0.75,-4.25) 6(-0.25,-4.25) 7(0.25,-4.25) 8(0.75,-4.25) 9(1.25,-4.25) 10(1.75,-4.25) 11(2.25,-4.25) 12(2.75,-4.25) 25(2.75,4.25) 26(2.25,4.25) 27(1.75,4.25) 28(1.25,4.25) 29(0.75,4.25) 30(0.25,4.25) 31(-0.25,4.25) 32(-0.75,4.25) 33(-1.25,4.25) 34(-1.75,4.25) 35(-2.25,4.25) 36(-2.75,4.25)
  oval 1.5x0.27 smd: 13(4.25,-2.75) 14(4.25,-2.25) 15(4.25,-1.75) 16(4.25,-1.25) 17(4.25,-0.75) 18(4.25,-0.25) 19(4.25,0.25) 20(4.25,0.75) 21(4.25,1.25) 22(4.25,1.75) 23(4.25,2.25) 24(4.25,2.75) 37(-4.25,2.75) 38(-4.25,2.25) 39(-4.25,1.75) 40(-4.25,1.25) 41(-4.25,0.75) 42(-4.25,0.25) 43(-4.25,-0.25) 44(-4.25,-0.75) 45(-4.25,-1.25) 46(-4.25,-1.75) 47(-4.25,-2.25) 48(-4.25,-2.75)
M2螺丝
  round 2 hole 2: 1(0,0)
QFN-24_L4.0-W4.0-P0.50-TL-EP2.6
  oval 0.8x0.28 smd: 1(-2,1.25) 2(-2,0.75) 3(-2,0.25) 4(-2,-0.25) 5(-2,-0.75) 6(-2,-1.25) 13(2,-1.25) 14(2,-0.75) 15(2,-0.25) 16(2,0.25) 17(2,0.75) 18(2,1.242)
  oval 0.28x0.8 smd: 7(-1.25,-2) 8(-0.75,-2) 9(-0.25,-2) 10(0.25,-2) 11(0.75,-2) 12(1.25,-2) 19(1.25,2) 20(0.75,2) 21(0.25,2) 22(-0.25,2) 23(-0.75,2) 24(-1.25,2)
  rect 2.7x2.7 smd: 25(0,-0.013)
R0805
  rect 1.133x1.377 smd: 1(-1,0) 2(1,0)
RES-TH_L5.1-W4.3-P3.40-D0.5
  round 1.524 hole 0.762: 1(0,1.7) 2(0,-1.7)
S8550P_SOT
  rect 1.25x0.701 smd: 1(1.292,-0.95) 2(1.292,0.95) 3(-1.208,0)
SOIC-8_L4.9-W3.9-P1.27-LS6.0-BL
  oval 0.588x2.045 smd: 1(-1.905,-2.772) 2(-0.635,-2.772) 3(0.635,-2.772) 4(1.905,-2.772) 5(1.905,2.772) 6(0.635,2.772) 7(-0.635,2.772) 8(-1.905,2.772)
SOIC-8_L5.3-W5.3-P1.27-LS8.0-BL
  oval 0.63x2.25 smd: 1(-1.905,-3.53) 2(-0.635,-3.53) 3(0.635,-3.53) 4(1.905,-3.53) 5(1.905,3.53) 6(0.635,3.53) 7(-0.635,3.53) 8(-1.905,3.53)
SOP_BCON
  oval 1.2x0.5 smd: 1(-1.905,1.651) 2(-1.905,0.751) 3(-1.905,-0.149) 4(0.095,-0.149) 5(0.095,1.651)
SOT-23-5_L2.9-W1.6-P0.95-LS2.8-BL
  rect 0.6x1 smd: 1(-0.95,-1.1) 2(0,-1.1) 3(0.95,-1.1) 4(0.95,1.1) 5(-0.95,1.1)
SPK-TH_BD23.0-P10.00-D0.8-L-RD
  rect 2.5x2.5 hole 1.1: 1(-5,0)
  round 2.5 hole 1.1: 2(5,0)
SSOP-20_L7.2-W5.3-P0.65-LS7.8-BL
  oval 0.364x2.082 smd: 1(-2.925,-3.491) 2(-2.275,-3.491) 3(-1.625,-3.491) 4(-0.975,-3.491) 5(-0.325,-3.491) 6(0.325,-3.491) 7(0.975,-3.491) 8(1.625,-3.491) 9(2.275,-3.491) 10(2.925,-3.491) 11(2.925,3.491) 12(2.275,3.491) 13(1.625,3.491) 14(0.975,3.491) 15(0.325,3.491) 16(-0.325,3.491) 17(-0.975,3.491) 18(-1.625,3.491) 19(-2.275,3.491) 20(-2.925,3.491)
USB_TYPE-C-16P
  oval 1.2x2 hole 0.7x1.7: 1(-4.193,1.765) 2(4.447,1.765)
  oval 1.2x1.8 hole 0.7x1.4: 3(-4.193,-2.415) 4(4.447,-2.415)
  rect 0.3x1.3 smd: A1(-3.223,2.415) A4(-2.423,2.415) A5(-1.123,2.415) A6(-0.123,2.415) A7(0.377,2.415) A8(1.377,2.415) A9(2.677,2.415) A12(3.477,2.415) B1(3.177,2.415) B4(2.377,2.415) B5(1.877,2.415) B6(0.877,2.415) B7(-0.623,2.415) B8(-1.623,2.415) B9(-2.123,2.415) B12(-2.923,2.415)

## Nets
As in the schematic.

Pads without a net: U3 1 10 11 12 13 14 15 16 17 18 19 22 23 24; U5 3 4; U6 4; U10 2 5 6; U11 6 20; U15 4; USB1 A8 B8

## Via types
v1: diameter 0.635, hole 0.381, Top Layer to Bottom Layer, 264 vias

## Routing (per net, layer and track width the routed paths; a pad name or vN(x,y) marks a point on that pad's centre or on a via; arc(x,y) is an arc through that point)
+3V3: length 334.1
  Top Layer w0.254: U3.6 11.83,22.63 v1(11.54,22.91) ; 47.43,27.29 47.43,28.18 47.43,28.18 47.43,27.29 ; 47.43,27.29 47.43,26.84 47.12,26.53 ; v1(11.54,22.91) 11.43,22.8 C19.2 ; v1(11.54,22.91) 12.39,22.91 U3.5 ; v1(81.69,16.32) 81.39,16.63 81.29,16.63 ; 52.91,22.35 U10.24 52.91,18.82 v1(53.62,18.11) 54.68,18.11 55.13,17.65 ; C30.1 47.41,30.58 U10.48
  Top Layer w0.381: 70.27,15.88 v1(70.27,14.13) ; 54.75,29.75 54.75,35.45 58.94,39.64 ; 65.3,24.49 65.32,24.49 ; 65.3,24.49 65.31,24.5 ; 65.3,24.49 64.22,24.49 ; 65.32,24.49 65.31,24.5 ; 65.32,24.49 65.98,24.49 ; 33.73,13.9 33.99,13.9 35.22,15.14 40.14,15.14 41.09,16.09 41.09,17.8 ; v1(52.75,25.25) 52.99,25.01 52.99,22.44 ; 14.32,18.17 14.32,17.16 11.28,14.12 11.05,14.12 ; 63.47,25.98 63.44,25.95 v1(62.54,25.95) ; C30.1 47.34,30.62 C28.1 43.53,30.62 43.47,30.68 34.85,30.68 ; 86.79,17.18 86.84,17.23 86.84,18.2 ; H1.5 83.31,57.53 82.3,56.52 76.2,56.52 73.79,54.1 73.79,40.53 72.98,39.73 ; 66.31,24.49 66.69,24.87 66.69,26.37 U12.7 ; 28.93,30.68 28.93,30.7 ; 28.93,30.68 30.47,30.68 ; 28.93,30.68 28.93,17.3 32.67,13.56 ; 28.93,30.68 24.24,30.68 23.47,31.45 23.47,34.59 ; 77.4,24.51 77.4,27.34 C4.2 77.22,27.28 v1(75.76,27.28) ; v1(81.49,28.34) 81.49,29.04 81.45,29.09 ; 78.03,17.14 78.03,16.27 v1(78.17,16.13) ; 77.62,12.35 78.02,12.76 78.02,13.54 ; 65.31,24.5 65.32,24.52 65.32,26.57 65.3,26.59 ; 51.12,13.02 55.32,13.02 v1(55.68,13.38) 56.11,13.81 56.9,13.81 57.28,13.43 ; v1(55.69,26.95) 55.1,26.95 54.69,26.54 ; 14.48,18.63 13.42,18.63 11.43,20.62 C19.2 ; 88.13,18.47 86.53,18.47 ; 81.72,29.52 81.49,29.52 81.49,30.9 v1(81.51,30.92) ; Q4.2 Q1.2 Q2.2 Q3.2 ; 88.18,18.67 88.34,18.67 88.34,15.85 92.5,11.68 95.51,11.68 97.67,9.53 ; v1(32.75,13.49) 33.31,13.49 33.58,13.75 ; 64.22,24.46 63.75,24.93 63.75,25.59 ; 54.49,29.82 54.54,29.77 54.54,26.83 54.27,26.56 ; 78.27,13.61 79.92,13.61
  Bottom Layer w0.254: 52.75,25.22 v1(52.75,25.25)
  Bottom Layer w0.381: 75.78,27.44 76.68,28.34 v1(81.49,28.34) ; v1(11.54,22.91) 11.71,23.08 11.71,25.35 15.67,29.31 20.51,29.31 22.98,31.78 22.98,34.6 22.92,34.67 22.74,34.67 ; 23.51,35.39 23.51,41.43 18.57,46.36 2.46,46.36 ; v1(62.54,25.95) 62.4,26.08 62.4,26.9 ; 47.39,26.51 48.96,26.51 49.72,25.75 ; v1(55.68,13.38) 53.62,15.44 v1(53.62,18.11) ; 49.85,25.63 52.37,25.63 v1(52.75,25.25) 53.05,25.25 53.25,25.45 54.97,25.45 55.41,25.89 55.41,26.67 v1(55.69,26.95) 61.41,26.95 61.63,26.73 62.06,26.73 62.08,26.75 62.21,26.75 62.74,27.28 75.7,27.28 ; 75.7,27.28 v1(75.76,27.28) ; 75.7,27.28 75.76,27.34 ; v1(81.51,30.92) 82.01,31.42 91.83,31.42 93.26,29.99 93.26,25.87 93.65,25.49 95.71,25.49 97.84,27.62 ; 77.65,12.43 78.17,12.94 v1(78.17,16.13) 81.5,16.13 v1(81.69,16.32) 86.6,16.32 86.89,16.62 86.89,16.91 86.78,17.02 ; 77.6,12.22 77.3,12.53 70.51,12.53 70.13,12.91 69.75,12.52 56.66,12.52 55.75,13.43 ; v1(70.27,14.13) 70.27,13.05
  vias: v1(22.73,35.31) v1(22.73,34.54) v1(23.52,35.31) v1(23.52,34.54) v1(43.43,30.62) v1(47.27,26.56) v1(52.28,13.08) v1(52.93,22.35) v1(77.62,12.27) v1(86.86,17.08)
GND: length 115.1
  Top Layer w0.254: 52.41,19.21 52.41,18.2 v1(52.78,17.82) ; 92.46,20.78 92.63,20.95 92.63,22.37 ; v1(63.57,29.3) 63.57,28.78 63.55,28.8 63.55,29.34 ; 46.13,22.98 46.95,22.98 47.22,23.25 47.22,25.48 47.45,25.71 ; 78.65,25.33 78.68,25.3 v1(78.68,23.25) ; 10.85,31.98 10.85,30.95 v1(10.88,30.93) ; U16.1 30.61,20.84 v1(30.61,23.05) ; v1(91.04,22.03) 91.9,22.03 92.12,22.26 ; 87.73,13.52 88.98,13.52 v1(89,13.54) ; v1(47.42,25.72) 47.91,26.21 U10.47 ; 12.94,33.06 12.94,32.14 v1(12.96,32.11) ; 11.41,18.38 v1(11.41,17.37) ; 53.82,25.99 53.33,25.99 v1(53.05,26.27) ; R22.2 45.34,34.82 v1(43.83,34.82) ; 45.85,8.46 43.38,8.46 v1(43.34,8.5) ; v1(13.21,28.69) 12.81,29.08 9.28,29.08 USB1.A1 ; 77.28,29.81 77.28,30.84 v1(77.26,30.86) ; 68.62,8.61 v1(66.41,8.61) ; 41.77,13.41 v1(42.59,13.41) ; 94.13,9.39 94.13,10.19 v1(94.14,10.21) ; v1(9.56,42.63) 9.54,42.62 8.77,42.62 ; 56.46,29.61 56.46,28.38 v1(56.5,28.34) ; 53.7,8.52 v1(55.21,8.52) ; 29.82,8.67 v1(31.97,8.67) ; 9.48,15.57 10.63,15.57 v1(10.68,15.52) ; C17.1 v1(19.18,30.1) ; 7.45,8.5 v1(8.76,8.5) ; USB1.1 7.42,27.54 USB1.A1 ; 9.13,15.89 7.42,17.6 USB1.A12 ; U15.2 v1(16.38,34.29) ; U16.3 v1(33.08,23.05) ; USB1.A1 USB1.B12 ; C14.2 v1(20.7,38.61) ; U16.7 31.81,24.5 v1(31.75,24.45) ; v1(40.17,19.69) 40.42,19.94 41,19.94 ; v1(34.42,23.05) 34.42,20.84 U16.4 ; 94.06,9.06 94.04,9.07 92.58,9.07 ; 57.85,17.66 58.53,17.66 v1(58.55,17.64) ; v1(74.82,13.46) 74.84,13.48 75.98,13.48 ; v1(20.08,8.84) 20.1,8.82 21.89,8.82 ; 79.46,29.59 79.46,30.77 v1(79.4,30.82) ; v1(69.87,18.79) 69.48,18.79 69.11,18.42 ; 85.39,29.66 v1(85.39,30.71) ; 83.52,29.34 v1(83.52,30.41) ; 64.54,13.63 65.76,13.63 v1(65.8,13.67) ; 23.65,51.57 24.79,51.57 v1(24.81,51.59) ; U16.2 v1(31.81,23.05) ; v1(89.66,8.76) 89.68,8.78 91.32,8.78 ; 77.03,8.67 v1(78.53,8.67) ; C18.1 v1(21.34,31.5) ; 18.67,13.58 v1(19.46,13.58)
  Top Layer w0.381: C30.2 45.23,32.64 C28.2 45.18,32.66 v1(43.79,32.66)
  Top Layer w0.508: v1(43.12,24.13) 43.12,22.8 v1(43.05,22.73) 42.56,22.24 C21.1 v1(40.44,22.24) v1(38.85,22.24) v1(38.23,22.86) 37.97,23.11 v1(37.97,24.43) v1(37.97,25.78) v1(37.97,27.18) 39.12,28.32 v1(39.37,28.32) v1(40.5,28.32) C20.1 42.33,28.32 v1(43.1,27.54) 43.1,26.21 v1(43.05,26.16) ; C13.2 v1(8.25,30.48) ; R18.2 19.54,41.15 v1(19.55,41.14) ; 11.56,40.38 11.44,40.26 v1(10.16,40.26)
  Bottom Layer w0.254: v1(98.04,12.27) 98.04,13.59 ; 56.48,28.3 56.12,28.3 54.08,26.26 53.08,26.26 ; v1(98.01,20.18) 98.01,20.22
  vias: v1(5.44,56.24) v1(5.44,30.84) v1(5.44,25.76) v1(5.44,15.6) v1(5.44,10.52) v1(5.44,5.44) v1(10.52,56.24) v1(10.52,10.52) v1(10.52,5.44) v1(15.6,56.24) v1(15.6,51.16) v1(15.6,30.84) v1(15.6,20.68) v1(15.6,15.6) v1(15.6,10.52) v1(15.6,5.44) v1(20.68,56.24) v1(20.68,41) v1(20.68,30.84) v1(20.68,20.68) v1(20.68,15.6) v1(20.68,10.52) v1(20.68,5.44) v1(25.76,56.24) v1(25.76,51.16) v1(25.76,46.08) v1(25.76,35.92) v1(25.76,25.76) v1(25.76,15.6) v1(25.76,10.52) v1(25.76,5.44) v1(30.84,56.24) v1(30.84,51.16) v1(30.84,46.08) v1(30.84,41) v1(30.84,10.52) v1(30.84,5.44) v1(35.92,56.24) v1(35.92,25.76) v1(35.92,10.52) v1(41,10.52) v1(41,5.44) v1(46.08,51.16) v1(46.08,46.08) v1(46.08,10.52) v1(46.08,5.44) v1(51.16,46.08) v1(51.16,5.44) v1(56.24,51.16) v1(56.24,35.92) v1(56.24,15.6) v1(56.24,5.44) v1(61.32,56.24) v1(61.32,51.16) v1(61.32,41) v1(61.32,25.76) v1(61.32,15.6) v1(66.4,56.24) v1(66.4,51.16) v1(66.4,41) v1(66.4,30.84) v1(66.4,5.44) v1(71.48,56.24) v1(71.48,51.16) v1(71.48,46.08) v1(71.48,41) v1(71.48,30.84) v1(71.48,25.76) v1(71.48,5.44) v1(76.56,51.16) v1(76.56,46.08) v1(76.56,41) v1(76.56,35.92) v1(76.56,30.84) v1(76.56,10.52) v1(81.64,51.16) v1(81.64,35.92) v1(81.64,20.68) v1(81.64,10.52) v1(86.72,56.24) v1(86.72,51.16) v1(86.72,46.08) v1(86.72,41) v1(86.72,15.6) v1(86.72,10.52) v1(91.8,56.24) v1(91.8,51.16) v1(91.8,35.92) v1(91.8,25.76) v1(91.8,10.52) v1(96.88,56.24) v1(96.88,51.16) v1(96.88,46.08) v1(96.88,41) v1(96.88,35.92) v1(96.88,30.84) v1(98.05,15.02)
VBAT: length 2.9
  Top Layer w0.254: 14.99,33.43 14.84,33.43 14.29,33.97 14.29,34.77 14.47,34.95 15.03,34.95 15.29,35.21
VBUS: length 33.2
  Top Layer w0.254: 6.31,25.81 6.31,21.96 6.79,21.48 7.45,21.48 7.47,21.5 ; 6.31,25.81 6.3,25.8 ; 6.31,25.81 6.77,26.28 6.99,26.28 ; 6.31,25.81 6.31,25.83 ; U3.7 13.36,21.1 ; 13.36,21.1 13.86,21.6 U3.8 ; 13.36,21.1 v1(12.85,20.6)
  Top Layer w0.508: R19.1 8.76,40.24 v1(8.76,38.48)
  Bottom Layer w0.254: 8.87,20.64 12.81,20.64 v1(12.85,20.6)
  Bottom Layer w0.762: v1(9.78,26.54) v1(9.78,27.36) v1(9.78,28.13) 9.78,36.58 ; v1(14.38,38.23) v1(13.59,38.23) ; 9.78,36.58 10.29,37.08 v1(13.59,37.08) v1(14.43,37.08) v1(15.27,37.08) ; 9.78,36.58 9.78,37.47 v1(8.76,38.48)
  vias: v1(8.89,21.34) v1(8.89,20.62) v1(8.89,19.94)
+VS: length 13.6
  Top Layer w0.254: 97.63,18.56 98,18.93 ; R28.1 92.6,16.76 C26.2 C24.2 ; 94.39,16.8 94.47,16.8 96.24,18.56 97.6,18.56 ; U5.5 98.03,16.58 98.03,19.17 ; 90.6,19.42 91.87,19.42 92.65,18.64
AM_BUSY: length 28.5
  Top Layer w0.254: U10.29 54.45,22.96 74.83,22.94 75.23,22.55 81.03,22.55 81.22,22.74 81.22,22.75 81.33,22.87 81.33,24.16
AM_CLK: length 29.3
  Top Layer w0.254: 72.89,21.46 54.45,21.46 U10.26 ; 72.89,21.46 74.37,21.46 74.66,21.18 79.5,21.18 80.67,20 v1(80.67,19.49) ; 80.66,19.33 80.66,17.46 80.64,17.44
AM_CS: length 27.9
  Top Layer w0.254: 80.02,19.77 80.02,18.03 79.98,17.99 ; U10.25 54.45,20.96 74.22,20.96 74.47,20.72 79.06,20.72 79.98,19.8
AM_DAT: length 32.3
  Top Layer w0.254: U10.28 54.45,22.46 72.9,22.46 ; v1(79.27,19.58) 79.27,17.46 79.3,17.43 ; 72.95,22.47 74.66,22.47 75.04,22.09 80.99,22.09 v1(81.19,21.89)
  Bottom Layer w0.254: v1(81.19,21.89) 81.19,21.43 79.35,19.58 v1(79.27,19.58)
AM_RST: length 35
  Top Layer w0.254: 79.35,24.87 79.33,24.89 ; 79.35,25.2 79.35,27.19 79.43,27.28 81.43,27.28 81.46,27.3 ; v1(80.29,21.44) 80.1,21.63 74.85,21.63 74.52,21.96 54.45,21.96 U10.27
  Bottom Layer w0.254: v1(80.29,21.44) 80.29,24.89 v1(79.35,25.82)
COM1: length 17.5
  Top Layer w0.254: 65.61,35.28 65.65,35.24 65.65,32.97 56.18,23.5 U10.30
COM2: length 22
  Top Layer w0.254: v1(70.28,34.15) 70.28,35.22 70.3,35.23 ; 64.45,32.57 64.45,34.1 v1(64.5,34.15) ; U10.31 54.43,24.01 55.97,24.01 64.45,32.49
  Bottom Layer w0.254: 64.48,34.15 v1(70.28,34.15)
COM3: length 26.1
  Top Layer w0.254: v1(74.52,33.93) 74.52,35.3 74.54,35.33 ; U10.32 54.42,24.51 55.77,24.51 63.33,32.07 63.33,33.36 v1(63.46,33.49)
  Bottom Layer w0.254: 63.52,33.46 74.04,33.46 v1(74.52,33.93)
COM4: length 14.9
  Top Layer w0.254: 62.14,34.09 62.79,33.45 62.79,32.21 55.57,24.99 54.8,24.99 ; 62.12,34.13 60.94,35.31 60.94,35.41
I2C_SCL: length 83.5
  Top Layer w0.254: v1(48.95,24.34) 48.95,27.97 U10.45 ; 96.97,16.44 97.1,16.57 97.1,17.77 v1(96.97,17.91) ; v1(33.08,24.57) U16.6 33.08,28.08 R30.1 ; U6.6 v1(98.84,17.91)
  Bottom Layer w0.254: v1(48.95,24.34) 48.46,24.34 45.06,20.95 34.38,20.95 33.73,21.6 33.73,23.74 32.99,24.47 32.99,24.56 ; v1(48.95,24.34) 49.14,24.15 52.35,24.15 52.47,24.03 65.62,24.03 67.13,22.53 72.2,22.53 76.89,17.84 95.63,17.84 95.74,17.95 ; v1(48.95,24.34) 49.05,24.34 ; v1(98.84,17.91) 97.13,17.91 ; 97.13,17.87 97.06,17.94 95.84,17.94
I2C_SDA: length 91.8
  Top Layer w0.254: v1(34.35,23.94) U16.5 34.67,26.64 R29.1 ; v1(97.37,12.94) 97.37,13.39 U5.1 ; v1(97.23,22.09) 97.23,21.62 97.24,21.61 U6.3 ; v1(47.98,25.09) 48.38,25.49 48.38,27.96 U10.46
  Bottom Layer w0.254: v1(97.23,22.09) 97.91,22.09 99.56,20.44 99.56,15.62 98.24,14.3 97.72,14.3 97.39,13.97 97.39,13.05 97.41,13.03 ; 78.57,19.07 78.98,18.66 95.57,18.66 96.72,19.8 96.72,21.59 97.18,22.05 ; 78.57,19.08 72.86,24.8 65.64,24.8 65.45,24.61 50.13,24.61 49.75,24.99 48.09,24.99 v1(47.98,25.09) 47.98,24.51 45.07,21.59 37,21.59 34.7,23.9 34.34,23.9
KEY1: length 67.2
  Top Layer w0.254: 21.87,3.66 21.84,3.63 7.26,3.58 7.04,3.8 ; U10.10 48.78,22 v1(48.9,21.88) ; 12.88,13.66 14.48,13.66 ; 14.48,13.66 14.48,3.66 14.51,3.63 ; 14.48,13.66 16.31,13.66 16.42,13.77 ; 22.58,3.61 v1(23.89,3.61)
  Bottom Layer w0.254: v1(23.89,3.61) 33.7,3.61 40.21,10.12 40.21,12.87 48.95,21.61 48.84,21.73
KEY2: length 45.1
  Top Layer w0.254: 39.38,13.46 39.38,13.52 39.42,13.55 ; 39.38,13.46 v1(39.38,11.79) ; 39.38,13.46 37.67,13.46 ; 37.72,3.67 45.12,3.67 45.16,3.71 ; U10.11 47.56,21.5 v1(47.74,21.32) ; 37.67,13.46 37.67,3.67 ; 37.67,13.46 35.8,13.46 ; 37.61,3.67 30.17,3.67 ; 39.42,13.46 39.47,13.46
  Bottom Layer w0.254: v1(47.74,21.32) 47.47,21.32 39.38,13.23 v1(39.38,11.79)
KEY3: length 48.7
  Top Layer w0.254: 53.31,3.58 53.31,4.83 45.5,12.63 45.5,12.63 45.5,20.72 45.76,20.97 ; 60.89,13.36 62.38,13.36 62.55,13.53 ; 60.89,13.36 60.89,3.57 ; 60.89,13.36 59.34,13.36 ; 60.89,3.57 53.52,3.57 ; 60.89,3.57 68.22,3.57 68.37,3.72
KEY4: length 73.1
  Top Layer w0.254: 76.66,3.7 74.58,3.7 v1(74.54,3.75) ; 84.08,3.66 84.22,3.6 91.27,3.6 91.41,3.75 ; 84.08,3.66 84.02,3.6 76.83,3.6 ; 84.08,3.66 84.08,13.63 ; 47.34,19.06 47.36,19.06 47.36,18.83 46.02,17.49 46.02,12.75 47.86,10.91 v1(49.94,10.91) ; 82.09,13.69 85.71,13.69 85.85,13.55 ; 76.7,3.74 76.63,3.8
  Bottom Layer w0.254: v1(49.94,10.91) 72.9,10.91 74.54,9.28 v1(74.54,3.75)
LED1: length 6.1
  Top Layer w0.254: LED2.1 48.33,14.43 47.8,14.43 47.62,14.61 47.62,17.7 48.41,18.5 U10.15
LED2: length 3.7
  Top Layer w0.254: U10.16 48.91,17.09 48.37,16.54 LED2.2
LED3: length 3.6
  Top Layer w0.254: U10.17 49.41,16.79 49.17,16.54 LED2.4
PWR_EN: length 49.4
  Top Layer w0.254: v1(53.72,27.99) 53.72,27.53 53.11,26.92 52.72,26.92 52.45,27.19 52.45,27.2 52.38,27.27 52.38,27.48 52.44,27.54 52.44,27.98 ; v1(85.33,20.45) 86.78,20.45 86.81,20.47 ; 87.05,20.39 88.31,20.39 88.42,20.5
  Bottom Layer w0.254: 81.1,29.21 80.74,29.56 80.74,30.9 80.04,31.6 54.54,31.6 53.77,30.83 53.77,28.04 v1(53.72,27.99) ; 81.1,29.18 82.39,29.18 82.57,29 82.57,23.22 v1(85.33,20.45)
RES_PHOTO: length 63.9
  Top Layer w0.254: 47.94,18.95 47.94,18.67 46.7,17.43 46.66,17.43 46.6,17.37 46.6,12.82 47.86,11.57 51.15,11.57 v1(51.15,11.57) ; 97.52,6.22 96.88,6.86 94.15,6.86 ; v1(94.12,5.91) 94.12,6.98 94.17,7.03
  Bottom Layer w0.254: v1(94.12,5.91) 93.93,5.73 75.53,5.73 75,6.26 75,9.47 72.73,11.73 51.24,11.73
RXD: length 49.6
  Top Layer w0.254: 51.39,19.94 51.38,19.94 51.38,22.77 v1(51.53,22.92) ; v1(18.91,27.46) 18.88,27.43 16.13,27.43 15.36,26.66 U3.20 ; v1(52.32,16.13) 51.41,17.04 U10.21
  Bottom Layer w0.254: 18.8,27.21 19.23,27.21 27.77,18.67 44.15,18.64 48.56,23.06 51.4,23.06 51.53,22.93 v1(51.53,22.92)
SEGA: length 28.2
  Top Layer w0.254: v1(50.11,26.63) 50.11,26.26 49.92,26.07 49.94,24.47 49.93,24.45 49.93,19.65 ; v1(36.31,36.33) 36.31,37.44
  Bottom Layer w0.254: v1(50.11,26.63) 50.11,28.88 50.42,29.19 47.72,31.9 47.46,31.9 47.41,31.84 40.44,31.84 36.31,35.97 v1(36.31,36.33)
SEGB: length 30.2
  Top Layer w0.254: U10.19 50.41,16.01 51.22,15.2 v1(51.24,15.2) ; 50.4,20.12 50.4,25.82 51.03,26.45 v1(51.03,26.58) ; v1(40.81,36.14) 40.81,37.34 40.92,37.34
  Bottom Layer w0.254: v1(51.03,26.58) 51.15,26.47 51.19,26.47 51.34,26.62 51.34,30.36 47.53,34.17 42.09,34.17 40.81,35.45 v1(40.81,36.14)
SEGC: length 22.9
  Top Layer w0.254: v1(50.83,35.51) 50.78,35.55 50.78,37.11 ; v1(51.31,16.13) 50.91,16.52 U10.20 ; v1(52,26.72) 51.88,26.6 51.88,26.34 50.88,25.34 50.88,19.53
  Bottom Layer w0.254: v1(52,26.72) 52.12,26.84 52.12,27.01 52.99,27.87 52.99,33.35 v1(50.83,35.51)
SEGD: length 12.2
  Top Layer w0.254: v1(51.31,33.92) 51.93,33.31 51.93,28.41 ; v1(46.44,36.17) 46.47,36.21 46.47,36.92
  Bottom Layer w0.254: v1(51.31,33.92) 51.31,33.93 49.11,36.13 46.6,36.13
SEGDP: length 10.2
  Top Layer w0.254: 48.5,37.38 48.25,37.14 48.25,35.38 49.48,34.15 49.48,29.47 49.91,29.05 49.91,27.95 49.92,27.94
SEGE: length 14.4
  Top Layer w0.254: 51.42,28.1 51.41,28.11 51.41,32.34 v1(51.28,32.46) ; v1(44.15,35.71) 44.19,35.75 44.19,37.1
  Bottom Layer w0.254: v1(51.28,32.46) 51.32,32.5 51.32,32.53 48.59,35.26 44.6,35.26 v1(44.15,35.71)
SEGF: length 18.2
  Top Layer w0.254: v1(50.6,30.14) 50.92,29.81 50.92,28.27 ; 38.34,37.49 38.38,37.45 v1(38.38,36.27)
  Bottom Layer w0.254: 50.59,30.19 47.22,33.56 40.62,33.56 38.38,35.81 v1(38.38,36.27)
SEGG: length 10.6
  Top Layer w0.254: 50.44,27.86 50.44,29.21 49.94,29.71 49.94,33.47 52.73,36.26 52.73,37.06 52.7,37.1
SPI_CS_AM: length 70.1
  Top Layer w0.254: 82.67,17.94 82.68,22.52 86.75,26.59 86.75,35.66 94.62,43.53 94.62,57.02 93.45,58.19 ; 82.67,17.94 82.67,17.16 ; 82.67,17.94 82.67,17.16 82.67,16.24 81.89,15.46 77.21,15.46 v1(76.72,15.94) 76.72,16.65 76.76,16.69 ; 65.37,19.25 65.28,19.17 v1(65.28,16.44)
  Bottom Layer w0.254: v1(76.72,15.94) 76.45,15.68 66.11,15.68 65.33,16.46
SPI_MISO: length 75.8
  Top Layer w0.254: 90.87,58.2 90.87,58.85 91.68,59.67 94.21,59.67 95.08,58.8 95.08,43.33 87.24,35.48 87.24,26.42 83.19,22.37 83.19,16.51 83.13,16.45 83.13,16.05 81.86,14.78 75.52,14.78 ; v1(75.45,15) 75.58,15 ; 75.42,16.89 75.42,15.22 75.58,15.05 ; 66.71,18.63 66.71,15.04 v1(66.69,15.03)
  Bottom Layer w0.254: v1(66.69,15.03) 67.92,15.03 67.95,15 75.44,15 v1(75.45,15)
SPI_MOSI: length 53
  Top Layer w0.254: 85.69,58.09 85.86,57.92 85.86,52.96 81.06,48.15 81.06,46.23 81.05,46.22 81.05,43.44 81.06,43.44 81.06,38.05 71.68,28.67 70.48,28.67 69.38,27.57 69.38,26.82 ; v1(68.61,24.02) 68.61,24.96 69.21,25.56 69.21,26.39 U12.5 ; v1(76.44,19.89) 76.09,19.53 76.09,18.1
  Bottom Layer w0.254: v1(76.44,19.89) 76.17,19.89 72.23,23.83 68.8,23.83 v1(68.61,24.02)
SPI_SCK: length 57.4
  Top Layer w0.254: 67.88,27.06 67.88,27.42 69.66,29.21 71.57,29.21 80.59,38.23 80.59,48.43 85.21,53.06 v1(85.21,55.25) ; v1(77.45,19.22) 77.34,19.11 77.34,17.78 ; U12.6 67.77,26.22 v1(67.77,23.82)
  Bottom Layer w0.254: v1(67.77,23.82) 67.77,23.71 68.11,23.38 72.04,23.38 76.2,19.22 v1(77.45,19.22) ; v1(85.21,55.25) 86.93,55.25 88.38,56.71 88.38,58.03
TXD: length 49.6
  Top Layer w0.254: v1(19.9,28.15) 19.86,28.12 16.09,28.12 14.83,26.86 14.83,26.24 ; v1(52.91,16.73) 51.91,17.72 U10.22 ; 51.92,20.13 51.92,22.4 52.18,22.66 52.18,23.29 v1(52.26,23.38)
  Bottom Layer w0.254: v1(52.26,23.38) 51.95,23.69 48.54,23.69 47.68,22.83 ; 47.67,22.81 45.2,20.34 27.91,20.34 20.14,28.11
USB_DN: length 10.4
  Top Layer w0.254: v1(10.69,25.17) 10.42,25.17 9.87,24.62 7.42,24.62 USB1.B7 ; U3.4 11.95,23.63 11.95,23.62 USB1.A7
  Bottom Layer w0.254: 11.12,23.59 11.15,23.62 11.15,24.75 10.78,25.12
  vias: v1(11,23.61)
USB_DP: length 9.9
  Top Layer w0.254: 10.46,24.25 10.45,24.25 10.45,24.25 ; 10.46,24.25 10.51,24.27 11.56,24.27 11.69,24.14 12.55,24.14 ; 10.46,24.25 v1(10.47,24.27) ; 10.46,24.25 10.45,24.25 ; 10.45,24.25 10.28,24.25 10.17,24.14 7.62,24.14 7.6,24.11 ; USB1.B6 10.14,23.12 v1(10.45,22.82)
  Bottom Layer w0.254: v1(10.47,24.27) 10.41,24.27 10.1,23.96 10.1,22.97 10.19,22.89
$1N1449: length 33.5
  Top Layer w0.254: 69.28,38.62 69.87,38.62 69.91,38.66
  Bottom Layer w0.254: DS1.8 53.81,47.16 55.5,45.47 68.45,45.47 69.09,44.83 v1(69.09,38.73)
$1N1467: length 3.2
  Top Layer w0.254: R5.2 44.07,41.96 DS1.1
$1N1471: length 3.1
  Top Layer w0.254: R4.2 46.19,39.49 DS1.2
$1N1475: length 3.1
  Top Layer w0.254: DS1.3 48.73,39.57 R8.2
$1N1479: length 3.3
  Top Layer w0.254: R3.2 51.27,39.96 DS1.4
$1N1483: length 3.5
  Top Layer w0.254: R7.2 53.81,40.46 DS1.5
$1N1487: length 26.1
  Top Layer w0.254: 46.19,56.1 DS1.11 ; 46.1,56.01 45.72,55.63 38.86,55.63 36.32,53.09 R1.2
$1N1491: length 31.5
  Top Layer w0.254: DS1.7 56.39,57.58 56.39,55.63 54.23,53.47 42.54,53.47 40.77,51.69 R2.2
$1N1495: length 27.2
  Top Layer w0.254: R6.2 38.35,53.09 39.75,54.48 47.75,54.48 48.77,55.5 48.77,57.58 DS1.10
$1N6161: length 6.3
  Top Layer w0.254: 80.6,25.26 80.6,25.43 81.07,25.9 84.71,25.9 85.47,26.65 C1.1
$1N6192: length 5.4
  Top Layer w0.254: R11.1 83.45,26.99 82.83,26.36 80.79,26.36 80,25.56 ; 79.98,24.19 79.98,25.25
$1N6375: length 27
  Top Layer w0.254: 82.61,44.8 82.64,44.77 82.64,38.98 72.74,29.08 72.74,28.42 74.82,26.34 76.15,26.34 76.72,25.78 76.72,24.32 76.7,24.3
$1N6384: length 25.3
  Top Layer w0.254: 77.95,25.46 77.95,26.15 78.33,26.53 ; 92.51,44.6 92.15,44.6 78.39,30.84 ; 78.35,26.53 78.35,30.81
$1N6917: length 3.9
  Top Layer w0.254: 68.07,15.75 67.84,15.97 67.82,16.81 67.82,19.5 67.84,19.53
$1N7212: length 6.6
  Top Layer w0.254: R13.2 43.69,17.91 44.45,18.67 44.45,22.04 44.91,22.5 U10.9
$1N7925: length 6.7
  Top Layer w0.254: X1.1 39.7,26.32 41.98,26.32 42.8,25.5 U10.3
$1N7930: length 6.7
  Top Layer w0.254: X1.2 41.31,23.9 42.41,25 U10.4
$1N8028: length 8.2
  Top Layer w0.254: R22.1 48.19,34.8 49.03,33.96 49.03,29.28 49.45,28.86 49.45,28.03 U10.44
$1N8104: length 0.9
  Top Layer w0.254: 49.24,13.61 49.24,14.42 49.19,14.47
$1N8256: length 35.7
  Top Layer w0.254: v1(60.07,38.73) Q1.3
  Bottom Layer w0.254: DS1.12 43.05,57.02 43.05,45.85 45.09,43.81 59.44,43.81 60.07,43.18 v1(60.07,38.73)
$1N8335: length 31.7
  Top Layer w0.254: Q2.3 v1(64.77,38.73)
  Bottom Layer w0.254: v1(64.77,38.73) 64.77,43.69 63.81,44.65 53.52,44.65 51.27,46.9 DS1.9
$1N8343: length 3.7
  Top Layer w0.254: Q4.3 56.45,42.28 DS1.6
$1N8477: length 2.2
  Top Layer w0.254: R24.2 63.65,35.33 63.65,37.53
$1N8481: length 2.3
  Top Layer w0.254: R25.2 68.47,35.44 68.47,37.53
$1N8485: length 2.7
  Top Layer w0.254: R26.2 72.66,35.3 72.66,37.78
$1N8489: length 2.5
  Top Layer w0.254: Q4.1 58.95,35.34 58.99,35.3
$1N8598: length 5.6
  Top Layer w0.254: U10.7 44.17,23.5 43.7,23.03 43.7,20.61 C22.2
$1N9384: length 10.1
  Top Layer w0.254: U6.1 98.93,21.55 98.93,22.22 98.43,22.73 C27.2 94.49,22.59 94.49,21.18 ; 94.49,21.18 94.6,21.07 R28.2 ; 94.49,21.18 C25.2
$1N9794: length 50.8
  Top Layer w0.254: v1(53.7,31.94) 53.62,31.94 52.9,31.21 52.9,28.26 ; v1(94.05,26.41) 94.05,25.47 93.6,25.02 93.6,24.95
  Bottom Layer w0.254: v1(94.05,26.41) 94.05,30.63 92.63,32.06 53.74,32.06
$1N9795: length 2.6
  Top Layer w0.254: R32.2 H2.1
$1N9824: length 43
  Top Layer w0.254: v1(92.47,32.89) 93.52,32.89 93.68,33.06 ; v1(62.05,32.88) 62.05,32.19 55.36,25.49 54.42,25.49 U10.34
  Bottom Layer w0.254: 61.92,32.84 92.41,32.84 v1(92.47,32.89)
$1N9825: length 2.4
  Top Layer w0.254: 98.13,32.75 97.9,32.98 95.8,32.98
$1N10135: length 54
  Top Layer w0.254: 42.46,29.67 36.85,29.67 v1(36.8,29.71) ; 42.46,29.68 44.02,28.12 44.02,26.68 44.2,26.5 U10.1
  Bottom Layer w0.254: v1(36.8,29.71) 17.29,49.22 2.2,49.22
$2N394: length 5.1
  Top Layer w0.254: R9.2 11.67,27.07 9.73,25.12 USB1.A5
$2N397: length 6.9
  Top Layer w0.254: R10.2 9.53,18.58 10.03,19.09 10.03,21.72 9.63,22.12 USB1.B5
$2N1836: length 4.1
  Top Layer w0.254: U3.9 14.36,20.75 16.21,18.89 15.99,18.67
$2N6448: length 2.9
  Top Layer w0.254: R18.1 16.27,41.28 13.56,41.28
$2N6491: length 2.5
  Top Layer w0.254: R20.2 6.36,42.54 LED5.1
$2N6496: length 2.8
  Top Layer w0.254: R19.2 6.5,40.01 LED4.2
$2N6506: length 12.1
  Top Layer w0.254: 2.79,41.4 1.87,42.33 LED5.2 ; 2.79,41.4 1.9,40.51 LED4.1 ; 2.79,41.4 10.58,41.4 10.7,41.28 11.56,41.28

## Copper pours and planes (outline as drawn; the poured copper is in the pictures)
+3V3 on Top Layer: 31.43,25.3 31.43,31.53 30.25,31.55 29.58,31.55 29.58,25.3
+3V3 on Top Layer: 35.69,29.89 31.23,29.85 31.22,31.43 35.56,31.43 35.69,31.3
+3V3 on Top Layer: 16.81,35.81 24.13,35.81 24.13,34.04 16.81,34.04
GND on Top Layer: -3.96,63.36 111.14,63.36 111.14,-7.56 -3.96,-7.56
GND on Bottom Layer: -3.81,60.85 106.69,60.85 106.69,-6.56 -3.81,-6.56
VBAT on Top Layer: 10.92,39.75 12.19,39.75 12.19,36.39 15.9,36.39 15.9,35.08 15.75,34.92 13.98,34.92 13.72,34.66 13.72,34.54 3.43,34.54 3.3,34.67 3.3,36.49 10.89,36.49 10.92,36.45
VBUS on Top Layer: 6.73,21.84 9.36,21.84 9.78,21.42 9.78,19.52 8.42,19.52 8.38,19.56 8.38,21.11 8.23,21.11 8.01,21.22 6.73,21.21 6.73,21.84
VBUS on Top Layer: 13.08,39.75 16.64,39.75 16.64,36.45 13.08,36.45
VBUS on Top Layer: 6.73,26.54 6.73,25.95 10.08,25.95 10.41,26.29 10.41,28.62 9.45,28.62 8.38,27.56 8.38,26.8 8.13,26.54
$1N10132 on Top Layer: 0.55,53.05 0.72,53.25 9.04,53.25 9.04,50.3 9.02,50.28 0.7,50.28 0.55,50.43

## Text on the board
Top Silkscreen Layer: +3V3 | VBAT
